# Altium project ECU_FEST24_Rev1.PrjPcb (part 1 of 2)
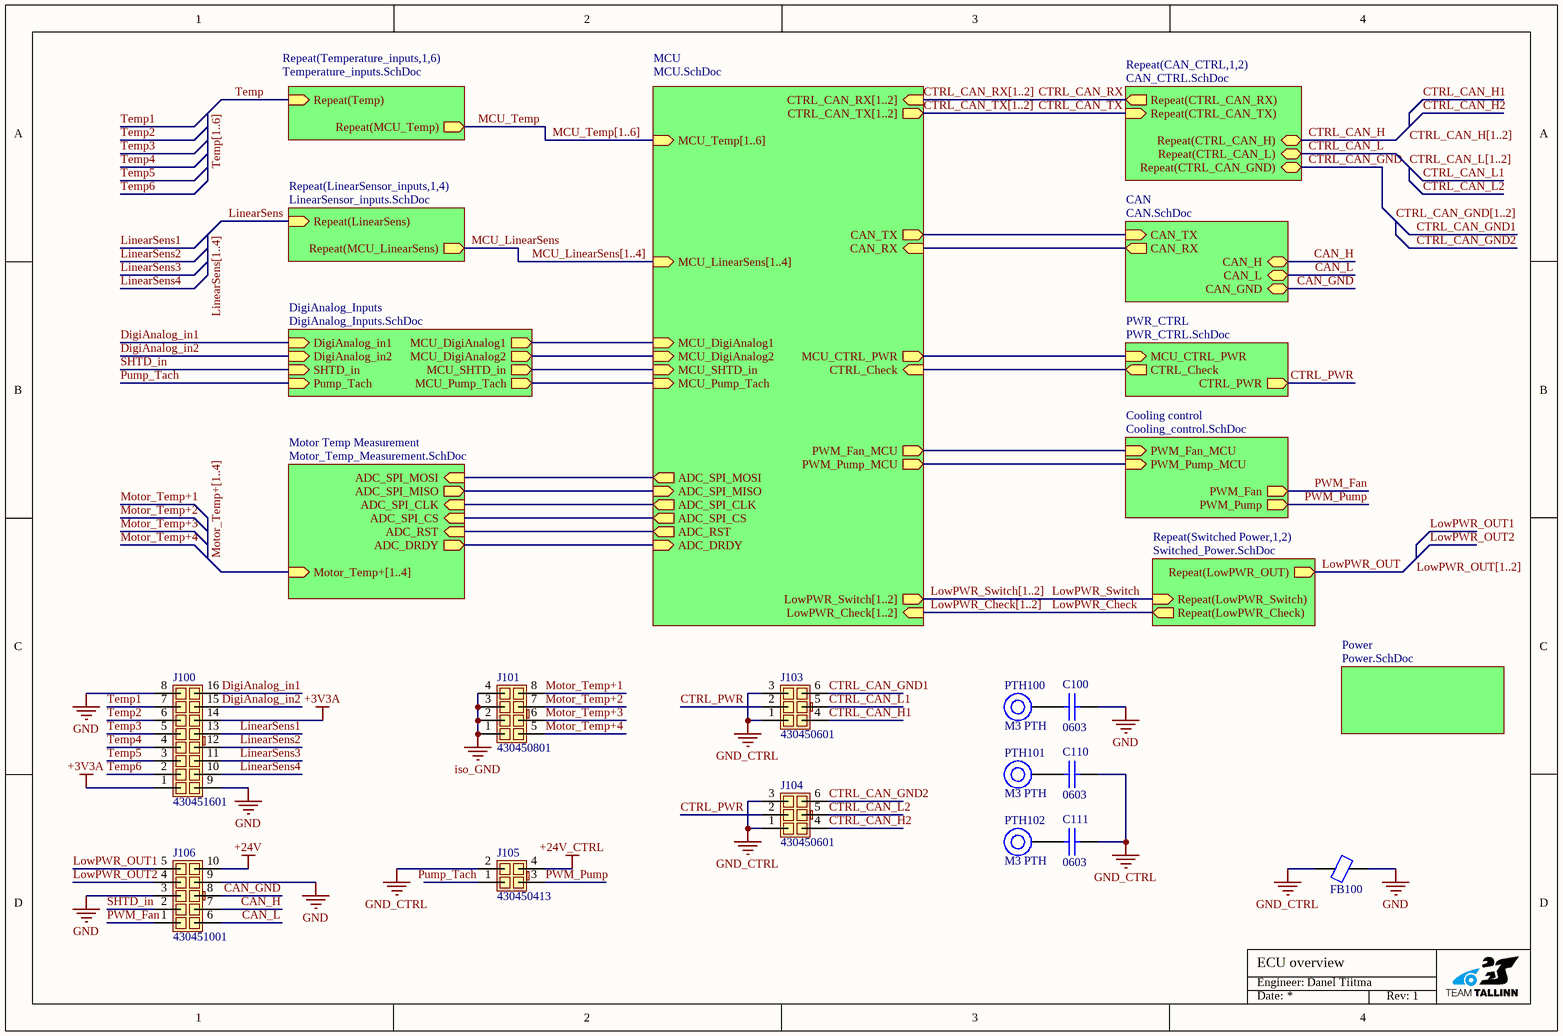
[diagram p0: Overview.SchDoc]
15 sheets, 278 parts. Net scope: hierarchical (ports join the sheet entries above them; power ports are global).
Board file: ECU_FEST24_Rev1.PcbDoc
Sheets:
  Overview.SchDoc
    Temperature_inputs1 = Temperature_inputs.SchDoc
    Temperature_inputs2 = Temperature_inputs.SchDoc
    Temperature_inputs3 = Temperature_inputs.SchDoc
    Temperature_inputs4 = Temperature_inputs.SchDoc
    Temperature_inputs5 = Temperature_inputs.SchDoc
    Temperature_inputs6 = Temperature_inputs.SchDoc
    LinearSensor_inputs1 = LinearSensor_inputs.SchDoc
    LinearSensor_inputs2 = LinearSensor_inputs.SchDoc
    LinearSensor_inputs3 = LinearSensor_inputs.SchDoc
    LinearSensor_inputs4 = LinearSensor_inputs.SchDoc
    MCU = MCU.SchDoc
      Debug = MCU_external_components.SchDoc
    Power = Power.SchDoc
    DigiAnalog_Inputs = DigiAnalog_Inputs.SchDoc
    Motor Temp Measurement = Motor_Temp_Measurement.SchDoc
      Wheatstone_bridge1 = Wheatstone_bridge.SchDoc
      Wheatstone_bridge2 = Wheatstone_bridge.SchDoc
      Wheatstone_bridge3 = Wheatstone_bridge.SchDoc
      Wheatstone_bridge4 = Wheatstone_bridge.SchDoc
      Isolated_Power = Isolated_Power.SchDoc
    Switched Power1 = Switched_Power.SchDoc
    Switched Power2 = Switched_Power.SchDoc
    Cooling control = Cooling_control.SchDoc
    CAN_CTRL1 = CAN_CTRL.SchDoc
    CAN_CTRL2 = CAN_CTRL.SchDoc
    CAN = CAN.SchDoc
    PWR_CTRL = PWR_CTRL.SchDoc

## Sheet Overview.SchDoc: ECU overview
size A4; Engineer: Danel Tiitma; Organization: MTÜ Tudengi Vormel; Address1: Pärnu mnt 62; Address2: Tallinn; Address3: Estonia, 10135; DocumentNumber: 1; Revision: 1; SheetNumber: 1; SheetTotal: 15

### Parts
C100  0603  [CAP [0603] 1608]
C110  0603  [CAP [0603] 1608]
C111  0603  [CAP [0603] 1608]
FB100  742792653  [IND [0603] 1608]  (value not drawn)
J100  430451601  [430451601]
J101  430450801  [430450801]
J103  430450601  [430450601]
J104  430450601  [430450601]
J105  430450413  [430450413]
J106  430451001  [430451001]
PTH100  M3 PTH  [M3 PTH]
PTH101  M3 PTH  [M3 PTH]
PTH102  M3 PTH  [M3 PTH]

### Sub-sheets
CAN = CAN.SchDoc: CAN_TX (in), CAN_RX (out), CAN_H (bidir), CAN_L (bidir), CAN_GND (bidir)
Cooling control = Cooling_control.SchDoc: PWM_Fan_MCU (in), PWM_Fan (out), PWM_Pump_MCU (in), PWM_Pump (out)
DigiAnalog_Inputs = DigiAnalog_Inputs.SchDoc: DigiAnalog_in1 (in), MCU_DigiAnalog1 (out), DigiAnalog_in2 (in), MCU_DigiAnalog2 (out), SHTD_in (in), Pump_Tach (in), MCU_Pump_Tach (out), MCU_SHTD_in (out)
MCU = MCU.SchDoc: MCU_Temp[1..6] (in), MCU_LinearSens[1..4] (in), CTRL_CAN_RX[1..2] (in), CTRL_CAN_TX[1..2] (out), MCU_CTRL_PWR (out), CTRL_Check (in), LowPWR_Switch[1..2] (out), LowPWR_Check[1..2] (in), MCU_DigiAnalog1 (in), MCU_DigiAnalog2 (in), MCU_Pump_Tach (in), MCU_SHTD_in (in), ADC_SPI_CLK (out), ADC_SPI_MOSI (out), ADC_SPI_CS (out), ADC_SPI_MISO (in), ADC_RST (out), ADC_DRDY (in), CAN_TX (out), CAN_RX (in), PWM_Fan_MCU (out), PWM_Pump_MCU (out)
Motor Temp Measurement = Motor_Temp_Measurement.SchDoc: ADC_SPI_CLK (in), ADC_SPI_MOSI (in), ADC_SPI_CS (in), ADC_SPI_MISO (out), ADC_RST (in), ADC_DRDY (out), Motor_Temp+[1..4] (in)
Power = Power.SchDoc: no entries
PWR_CTRL = PWR_CTRL.SchDoc: MCU_CTRL_PWR (in), CTRL_Check (out), CTRL_PWR (out)
Repeat(CAN_CTRL,1,2) = CAN_CTRL.SchDoc: Repeat(CTRL_CAN_TX) (in), Repeat(CTRL_CAN_RX) (out), Repeat(CTRL_CAN_H) (bidir), Repeat(CTRL_CAN_L) (bidir), Repeat(CTRL_CAN_GND) (bidir)
Repeat(LinearSensor_inputs,1,4) = LinearSensor_inputs.SchDoc: Repeat(MCU_LinearSens) (out), Repeat(LinearSens) (in)
Repeat(Switched Power,1,2) = Switched_Power.SchDoc: Repeat(LowPWR_Switch) (in), Repeat(LowPWR_OUT) (out), Repeat(LowPWR_Check) (out)
Repeat(Temperature_inputs,1,6) = Temperature_inputs.SchDoc: Repeat(MCU_Temp) (out), Repeat(Temp) (in)

### Nets
+3V3A: J100.1 J100.14
+24V: J106.10
+24V_CTRL: J105.4
GND: C100.1 FB100.2 J100.8 J100.9 J106.3 J106.9
GND_CTRL: C110.2 C111.2 FB100.1 J103.1 J103.3 J104.1 J104.3 J105.2
iso_GND: J101.1 J101.2 J101.3 J101.4
ADC_DRDY: sheet MCU/ADC_DRDY, sheet Motor Temp Measurement/ADC_DRDY
ADC_RST: sheet MCU/ADC_RST, sheet Motor Temp Measurement/ADC_RST
CAN_GND: J106.8 ; sheet CAN/CAN_GND
CAN_H: J106.7 ; sheet CAN/CAN_H
CAN_L: J106.6 ; sheet CAN/CAN_L
CAN_RX: sheet MCU/CAN_RX, sheet CAN/CAN_RX
CAN_TX: sheet MCU/CAN_TX, sheet CAN/CAN_TX
CTRL_CAN_GND: sheet Repeat(CAN_CTRL,1,2)/Repeat(CTRL_CAN_GND)
CTRL_CAN_GND1: J103.6  [project net CTRL_CAN_GND]
CTRL_CAN_GND2: J104.6  [project net CTRL_CAN_GND]
CTRL_CAN_H: sheet Repeat(CAN_CTRL,1,2)/Repeat(CTRL_CAN_H)
CTRL_CAN_H1: J103.4  [project net CTRL_CAN_H]
CTRL_CAN_H2: J104.4  [project net CTRL_CAN_H]
CTRL_CAN_L: sheet Repeat(CAN_CTRL,1,2)/Repeat(CTRL_CAN_L)
CTRL_CAN_L1: J103.5  [project net CTRL_CAN_L]
CTRL_CAN_L2: J104.5  [project net CTRL_CAN_L]
CTRL_CAN_RX: sheet Repeat(CAN_CTRL,1,2)/Repeat(CTRL_CAN_RX)
CTRL_CAN_TX: sheet Repeat(CAN_CTRL,1,2)/Repeat(CTRL_CAN_TX)
CTRL_PWR: J103.2 J104.2 ; sheet PWR_CTRL/CTRL_PWR
DigiAnalog_in1: J100.16 ; sheet DigiAnalog_Inputs/DigiAnalog_in1
DigiAnalog_in2: J100.15 ; sheet DigiAnalog_Inputs/DigiAnalog_in2
LinearSens: sheet Repeat(LinearSensor_inputs,1,4)/Repeat(LinearSens)
LinearSens1: J100.13
LinearSens2: J100.12
LinearSens3: J100.11
LinearSens4: J100.10
LowPWR_Check: sheet Repeat(Switched Power,1,2)/Repeat(LowPWR_Check)
LowPWR_OUT: sheet Repeat(Switched Power,1,2)/Repeat(LowPWR_OUT)
LowPWR_OUT1: J106.5  [project net LowPWR_OUT]
LowPWR_OUT2: J106.4  [project net LowPWR_OUT]
LowPWR_Switch: sheet Repeat(Switched Power,1,2)/Repeat(LowPWR_Switch)
MCU_DigiAnalog1: sheet MCU/MCU_DigiAnalog1, sheet DigiAnalog_Inputs/MCU_DigiAnalog1
MCU_DigiAnalog2: sheet MCU/MCU_DigiAnalog2, sheet DigiAnalog_Inputs/MCU_DigiAnalog2
MCU_LinearSens: sheet Repeat(LinearSensor_inputs,1,4)/Repeat(MCU_LinearSens)
MCU_Pump_Tach: sheet MCU/MCU_Pump_Tach, sheet DigiAnalog_Inputs/MCU_Pump_Tach
MCU_SHTD_in: sheet MCU/MCU_SHTD_in, sheet DigiAnalog_Inputs/MCU_SHTD_in
MCU_SPI_CLK: sheet MCU/ADC_SPI_CLK, sheet Motor Temp Measurement/ADC_SPI_CLK
MCU_SPI_CS: sheet MCU/ADC_SPI_CS, sheet Motor Temp Measurement/ADC_SPI_CS
MCU_SPI_MISO: sheet MCU/ADC_SPI_MISO, sheet Motor Temp Measurement/ADC_SPI_MISO
MCU_SPI_MOSI: sheet MCU/ADC_SPI_MOSI, sheet Motor Temp Measurement/ADC_SPI_MOSI
MCU_Temp: sheet Repeat(Temperature_inputs,1,6)/Repeat(MCU_Temp)
Motor_Temp+1: J101.8
Motor_Temp+2: J101.7
Motor_Temp+3: J101.6
Motor_Temp+4: J101.5
Pump_Tach: J105.1 ; sheet DigiAnalog_Inputs/Pump_Tach
PWM_Fan: J106.1 ; sheet Cooling control/PWM_Fan
PWM_Pump: J105.3 ; sheet Cooling control/PWM_Pump
SHTD_in: J106.2 ; sheet DigiAnalog_Inputs/SHTD_in
Temp: sheet Repeat(Temperature_inputs,1,6)/Repeat(Temp)
Temp1: J100.7
Temp2: J100.6
Temp3: J100.5
Temp4: J100.4
Temp5: J100.3
Temp6: J100.2
NetC100_2: C100.2 PTH100.1
NetC110_1: C110.1 PTH101.1
NetC111_1: C111.1 PTH102.1
NetC303_1: sheet MCU/CTRL_Check, sheet PWR_CTRL/CTRL_Check
NetQ500_2: sheet MCU/PWM_Pump_MCU, sheet Cooling control/PWM_Pump_MCU
NetQ501_2: sheet MCU/PWM_Fan_MCU, sheet Cooling control/PWM_Fan_MCU
NetR301_1: sheet MCU/MCU_CTRL_PWR, sheet PWR_CTRL/MCU_CTRL_PWR

### Buses and harness runs
bus CTRL_CAN_GND[1..2]
bus CTRL_CAN_H[1..2]
bus CTRL_CAN_L[1..2]
bus CTRL_CAN_RX[1..2] = sheet MCU/CTRL_CAN_RX[1..2]
bus CTRL_CAN_TX[1..2] = sheet MCU/CTRL_CAN_TX[1..2]
bus LinearSens[1..4]
bus LowPWR_Check[1..2] = sheet MCU/LowPWR_Check[1..2]
bus LowPWR_OUT[1..2]
bus LowPWR_Switch[1..2] = sheet MCU/LowPWR_Switch[1..2]
bus MCU_LinearSens[1..4] = sheet MCU/MCU_LinearSens[1..4]
bus MCU_Temp[1..6] = sheet MCU/MCU_Temp[1..6]
bus Motor_Temp+[1..4] = sheet Motor Temp Measurement/Motor_Temp+[1..4]
bus Temp[1..6]

### Notes on the sheet
- Engineer:
- Date:
- Rev:

### Library data of the parts
C100 C110 C111 = CMP-001-00084-16: Default capacitor part; Supplier Part Number: *; Supplier: *; Manufacturer Part Number: *
FB100 = CMP-006-00000-2: Ferrite Chip, 1 Function(s), 0.5A, 2 Pin(s); Manufacturer: WURTH ELEKTRONIK; Price: 0,183; Supplier: Farnell; Manufacturer Part Number: 742792653; Supplier Part Number: 1635686
J100 = CMP-002-00099-1: Rectangular Power Connector, 16 Contact(s), Male, Solder Terminal, Receptacle; Manufacturer: Molex; Manufacturer Part Number: 43045-1601; Price: 5,60; Supplier: Mouser; Supplier Part Number: 538-43045-1601
J101 = CMP-002-00003-1: Rectangular Power Connector, 8 Contact(s), Male, Solder Terminal, Receptacle; Manufacturer: Molex; Manufacturer Part Number: 43045-0801; Price: 2,9; Supplier Part Number: 538-43045-0801; Supplier: Mouser
J103 J104 = CMP-002-00002-1: Rectangular Power Connector, 6 Contact(s), Male, Solder Terminal, Receptacle; Manufacturer: Molex; Manufacturer Part Number: 43045-0601; Supplier Part Number: 538-43045-0601; Supplier: Mouser; Price: 2,37
J105 = CMP-002-00010-1: Rectangular Power Connector, 4 Contact(s), Male, Solder Terminal, Receptacle; Manufacturer Part Number: 43045-0413; Manufacturer: Molex; Supplier Part Number: 538-43045-0413; Supplier: Mouser; Price: 0,763
J106 = CMP-00009-2: Rectangular Power Connector, 10 Contact(s), Male, Solder Terminal, Receptacle; Manufacturer: Molex; Design Item ID: 430451001; Supplier: Mouser; Supplier Part Number: 538-43045-1001; Datasheet: https://www.molex.com/pdm_docs/sd/430451000_sd.pdf; Manufacturer Part Number: 430451001; Price: 3,74 €
PTH100-PTH102 = CMP-00028-00000-3: M3 plated through hole for mounting; Manufacturer Part Number: *; Supplier Part Number: *; Supplier: *

## Sheet Temperature_inputs.SchDoc: Analog temperature
size A4; Engineer: Rain Sarapuu; DocumentNumber: 9; Revision: 1; SheetNumber: 10; SheetTotal: 15
Used 6 times, as channels Temperature_inputs1, Temperature_inputs2, Temperature_inputs3, Temperature_inputs4, Temperature_inputs5, Temperature_inputs6. Parts and nets are listed once, with the designators drawn on the sheet.
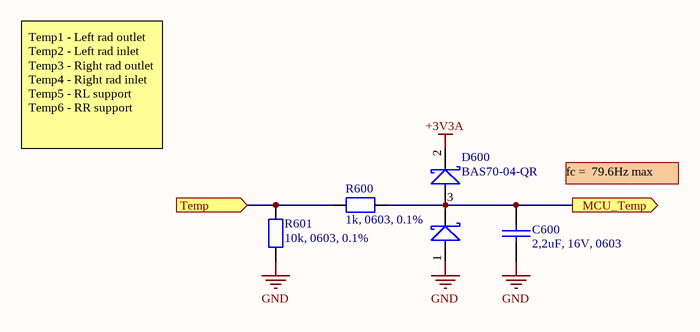
[diagram p1: Temperature_inputs.SchDoc]

### Parts
C600  2,2uF, 16V, 0603  [CAP [0603] 1608]
D600  BAS70-04-QR  [SOT23-3]
R600  1k, 0603, 0.1%  [RES [0603] 1608]
R601  10k, 0603, 0.1%  [RES [0603] 1608]

### Ports
MCU_Temp (out), Temp (in)

### Nets
+3V3A: D600.2
GND: C600.2 D600.1 R601.2
MCU_Temp: C600.1 D600.3 R600.1 ; port MCU_Temp
Temp: R600.2 R601.1 ; port Temp

### Channels
Temperature_inputs1: designators end in 1; ports MCU_Temp=MCU_Temp1 Temp=Temp1
Temperature_inputs2: designators end in 2; ports MCU_Temp=MCU_Temp2 Temp=Temp2
Temperature_inputs3: designators end in 3; ports MCU_Temp=MCU_Temp3 Temp=Temp3
Temperature_inputs4: designators end in 4; ports MCU_Temp=MCU_Temp4 Temp=Temp4
Temperature_inputs5: designators end in 5; ports MCU_Temp=MCU_Temp5 Temp=Temp5
Temperature_inputs6: designators end in 6; ports MCU_Temp=MCU_Temp6 Temp=Temp6

### Notes on the sheet
- Temp1 - Left rad outlet
  Temp2 - Left rad inlet
  Temp3 - Right rad outlet
  Temp4 - Right rad inlet
  Temp5 - RL support
  Temp6 - RR support
- fc =  79.6Hz max
- Engineer:
- Date:
- Rev:

### Library data of the parts
C600 = CMP-001-00084-16: Default capacitor part; Supplier Part Number: *; Supplier: *; Manufacturer Part Number: *
D600 = CMP-004-00033-4: Diode Small Signal Schottky 70V 70mA 3-Pin SOT-23 T/R; Manufacturer: Nexperia; Supplier Part Number: 771-BAS70-04-QR; Manufacturer Part Number: BAS70-04-QR; Supplier: Mouser; Price: 0,242
R600 R601 = CMP-009-00038-12: Standard resistor part; Supplier Part Number: *; Manufacturer Part Number: *; Supplier: *

## Sheet LinearSensor_inputs.SchDoc: Linear sensor input
size A4; Engineer: Danel Tiitma; Organization: MTÜ Tudengi Vormel; Address1: Pärnu mnt 62; Address2: Tallinn; Address3: Estonia, 10135; DocumentNumber: 10; Revision: 1; SheetNumber: 11; SheetTotal: 15
Used 4 times, as channels LinearSensor_inputs1, LinearSensor_inputs2, LinearSensor_inputs3, LinearSensor_inputs4. Parts and nets are listed once, with the designators drawn on the sheet.
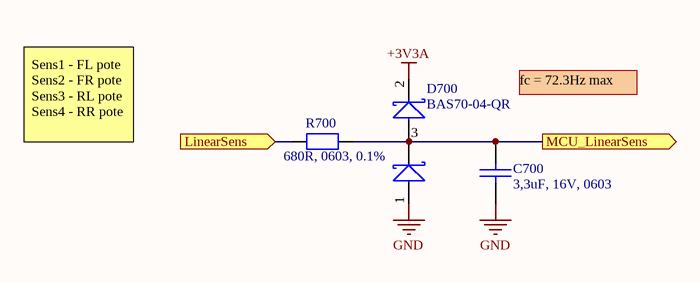
[diagram p2: LinearSensor_inputs.SchDoc]

### Parts
C700  3,3uF, 16V, 0603  [CAP [0603] 1608]
D700  BAS70-04-QR  [SOT23-3]
R700  680R, 0603, 0.1%  [RES [0603] 1608]

### Ports
LinearSens (in), MCU_LinearSens (out)

### Nets
+3V3A: D700.2
GND: C700.2 D700.1
LinearSens: R700.2 ; port LinearSens
MCU_LinearSens: C700.1 D700.3 R700.1 ; port MCU_LinearSens

### Channels
LinearSensor_inputs1: designators end in 1; ports LinearSens=LinearSens1 MCU_LinearSens=MCU_LinearSens1
LinearSensor_inputs2: designators end in 2; ports LinearSens=LinearSens2 MCU_LinearSens=MCU_LinearSens2
LinearSensor_inputs3: designators end in 3; ports LinearSens=LinearSens3 MCU_LinearSens=MCU_LinearSens3
LinearSensor_inputs4: designators end in 4; ports LinearSens=LinearSens4 MCU_LinearSens=MCU_LinearSens4

### Notes on the sheet
- fc = 72.3Hz max
- Sens1 - FL pote
  Sens2 - FR pote
  Sens3 - RL pote
  Sens4 - RR pote
- Engineer:
- Date:
- Rev:

### Library data of the parts
C700 = CMP-001-00084-16: Default capacitor part; Supplier Part Number: *; Supplier: *; Manufacturer Part Number: *
D700 = CMP-004-00033-4: as D600 on sheet Temperature_inputs; Supplier Part Number: 771-BAS70-04-QR; Manufacturer Part Number: BAS70-04-QR; Supplier: Mouser; Price: 0,242
R700 = CMP-009-00038-12: Standard resistor part; Supplier Part Number: *; Manufacturer Part Number: *; Supplier: *

## Sheet MCU.SchDoc: MCU
size A4; Engineer: Danel Tiitma; DocumentNumber: 3; Revision: 1; SheetNumber: 3; SheetTotal: 15
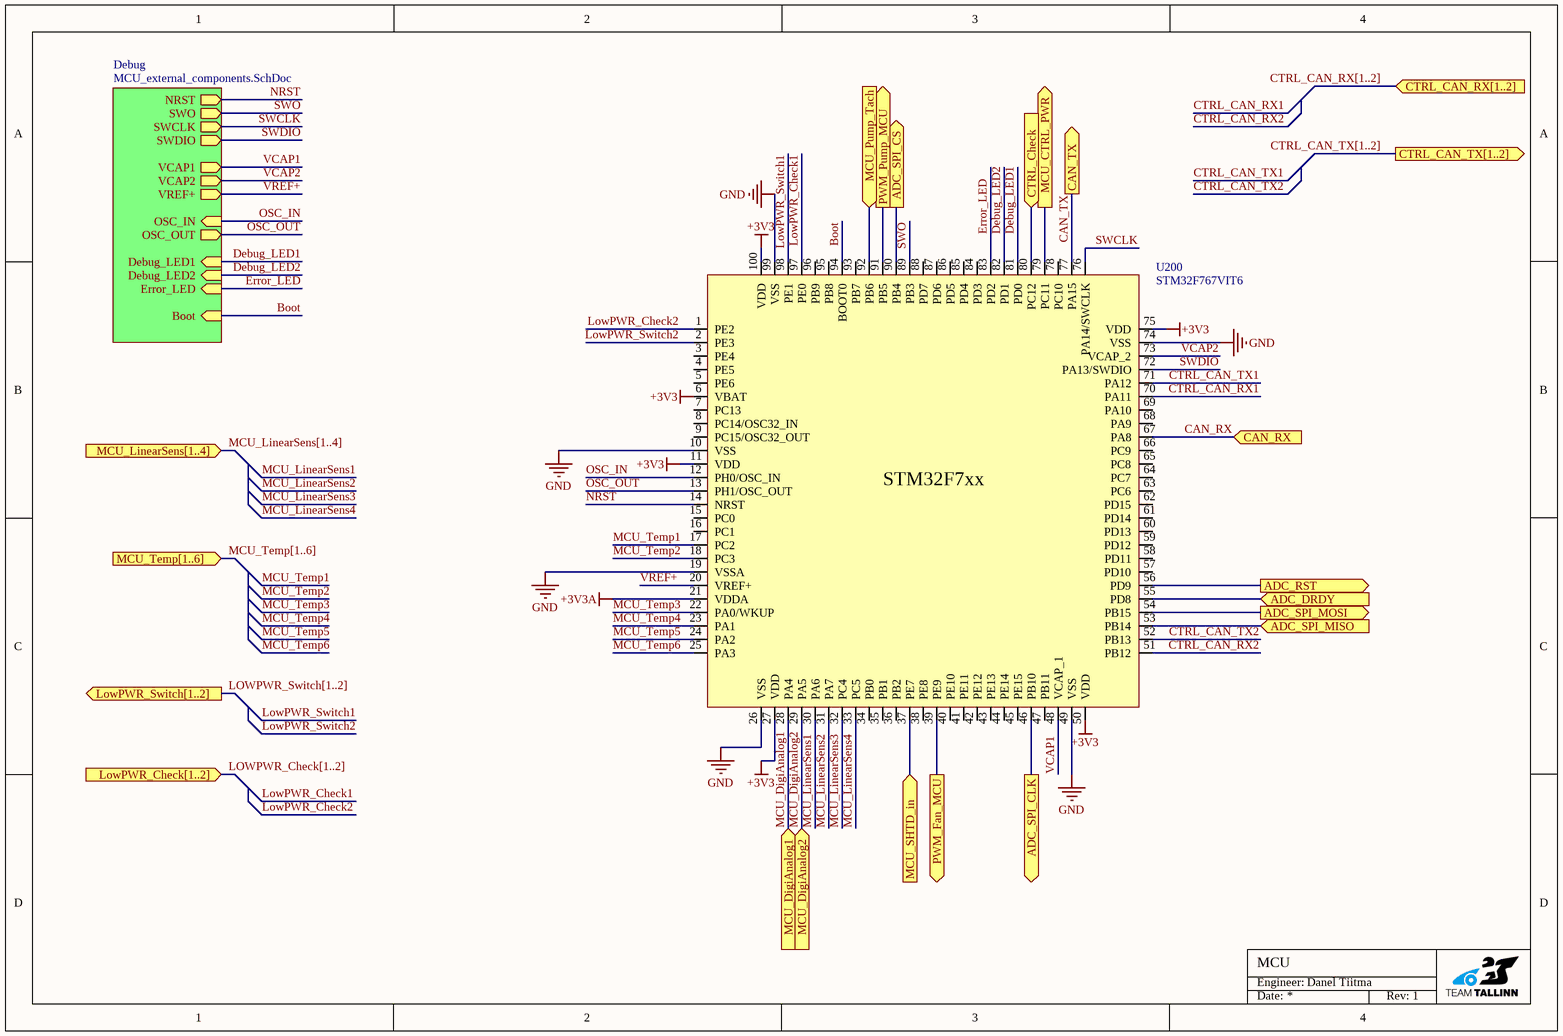
[diagram p3: MCU.SchDoc]

### Parts
U200  STM32F767VIT6  [LQFP-100]

### Sub-sheets
Debug = MCU_external_components.SchDoc: SWO (out), NRST (out), SWDIO (out), SWCLK (out), VCAP2 (out), OSC_IN (in), OSC_OUT (out), VREF+ (out), Debug_LED1 (in), Debug_LED2 (in), Error_LED (in), Boot (in), VCAP1 (out)

### Ports
ADC_DRDY (in), ADC_RST (out), ADC_SPI_CLK (out), ADC_SPI_CS (out), ADC_SPI_MISO (in), ADC_SPI_MOSI (out), CAN_RX (in), CAN_TX (out), CTRL_CAN_RX[1..2] (in), CTRL_CAN_TX[1..2] (out), CTRL_Check (in), LowPWR_Check[1..2] (in), LowPWR_Switch[1..2] (out), MCU_CTRL_PWR (out), MCU_DigiAnalog1 (in), MCU_DigiAnalog2 (in), MCU_LinearSens[1..4] (in), MCU_Pump_Tach (in), MCU_SHTD_in (in), MCU_Temp[1..6] (in), PWM_Fan_MCU (out), PWM_Pump_MCU (out)

### Nets
+3V3: U200.6(VBAT) U200.11(VDD) U200.27(VDD) U200.50(VDD) U200.75(VDD) U200.100(VDD)
+3V3A: U200.21(VDDA)
GND: U200.10(VSS) U200.19(VSSA) U200.26(VSS) U200.49(VSS) U200.74(VSS) U200.99(VSS)
ADC_DRDY: U200.55(PD8) ; port ADC_DRDY
ADC_RST: U200.56(PD9) ; port ADC_RST
Boot: U200.94(BOOT0) ; sheet Debug/Boot
CAN_RX: U200.67(PA8) ; port CAN_RX
CAN_TX: U200.77(PA15) ; port CAN_TX
CTRL_CAN_RX1: U200.70(PA11)  [project net CTRL_CAN_RX]
CTRL_CAN_RX2: U200.51(PB12)  [project net CTRL_CAN_RX]
CTRL_CAN_TX1: U200.71(PA12)  [project net CTRL_CAN_TX]
CTRL_CAN_TX2: U200.52(PB13)  [project net CTRL_CAN_TX]
Debug_LED1: U200.81(PD0) ; sheet Debug/Debug_LED1
Debug_LED2: U200.82(PD1) ; sheet Debug/Debug_LED2
Error_LED: U200.83(PD2) ; sheet Debug/Error_LED
LowPWR_Check1: U200.97(PE0)
LowPWR_Check2: U200.1(PE2)
LowPWR_Switch1: U200.98(PE1)
LowPWR_Switch2: U200.2(PE3)
MCU_DigiAnalog1: U200.28(PA4) ; port MCU_DigiAnalog1
MCU_DigiAnalog2: U200.29(PA5) ; port MCU_DigiAnalog2
MCU_LinearSens1: U200.30(PA6)
MCU_LinearSens2: U200.31(PA7)
MCU_LinearSens3: U200.32(PC4)
MCU_LinearSens4: U200.33(PC5)
MCU_Pump_Tach: U200.92(PB6) ; port MCU_Pump_Tach
MCU_SHTD_in: U200.37(PE7) ; port MCU_SHTD_in
MCU_SPI_CLK: U200.46(PB10) ; port ADC_SPI_CLK
MCU_SPI_CS: U200.90(PB4) ; port ADC_SPI_CS
MCU_SPI_MISO: U200.53(PB14) ; port ADC_SPI_MISO
MCU_SPI_MOSI: U200.54(PB15) ; port ADC_SPI_MOSI
MCU_Temp1: U200.17(PC2)
MCU_Temp2: U200.18(PC3)
MCU_Temp3: U200.22(PA0/WKUP)
MCU_Temp4: U200.23(PA1)
MCU_Temp5: U200.24(PA2)
MCU_Temp6: U200.25(PA3)
NRST: U200.14(NRST) ; sheet Debug/NRST
OSC_IN: U200.12(PH0/OSC_IN) ; sheet Debug/OSC_IN
OSC_OUT: U200.13(PH1/OSC_OUT) ; sheet Debug/OSC_OUT
SWCLK: U200.76(PA14/SWCLK) ; sheet Debug/SWCLK
SWDIO: U200.72(PA13/SWDIO) ; sheet Debug/SWDIO
SWO: U200.89(PB3) ; sheet Debug/SWO
VCAP1: U200.48(VCAP_1) ; sheet Debug/VCAP1
VCAP2: U200.73(VCAP_2) ; sheet Debug/VCAP2
VREF+: U200.20(VREF+) ; sheet Debug/VREF+
NetC303_1: U200.80(PC12) ; port CTRL_Check
NetQ500_2: U200.91(PB5) ; port PWM_Pump_MCU
NetQ501_2: U200.39(PE9) ; port PWM_Fan_MCU
NetR301_1: U200.79(PC11) ; port MCU_CTRL_PWR

Not connected (* = marked no-connect by the designer): U200 3(PE4) 4(PE5) 5(PE6) 7(PC13) 8(PC14/OSC32_IN) 9(PC15/OSC32_OUT) 15(PC0) 16(PC1) 34(PB0) 35(PB1) 36(PB2) 38(PE8) 40(PE10) 41(PE11) 42(PE12) 43(PE13) 44(PE14) 45(PE15) 47(PB11) 57(PD10) 58(PD11) 59(PD12) 60(PD13) 61(PD14) 62(PD15) 63(PC6) 64(PC7) 65(PC8) 66(PC9) 68(PA9) 69(PA10) 78(PC10) 84(PD3) 85(PD4) 86(PD5) 87(PD6) 88(PD7) 93(PB7) 95(PB8) 96(PB9)

### Buses and harness runs
bus CTRL_CAN_RX[1..2] = port CTRL_CAN_RX[1..2]
bus CTRL_CAN_TX[1..2] = port CTRL_CAN_TX[1..2]
bus LOWPWR_Check[1..2] = port LowPWR_Check[1..2]
bus LOWPWR_Switch[1..2] = port LowPWR_Switch[1..2]
bus MCU_LinearSens[1..4] = port MCU_LinearSens[1..4]
bus MCU_Temp[1..6] = port MCU_Temp[1..6]

### Notes on the sheet
- Engineer:
- Date:
- Rev:
- (in symbol CMP-020-00001-1) STM32F7xx

### Library data of the parts
U200 = CMP-020-00001-1: RISC Microcontroller, 32-Bit, 216MHz; Manufacturer: STMICROELECTRONICS; Manufacturer Part Number: STM32F767VIT6; Supplier: Mouser; Supplier Part Number: 511-STM32F767VIT6

## Sheet MCU_external_components.SchDoc: MCU ext. components
size A4; Engineer: Danel Tiitma; Organization: MTÜ Tudengi Vormel; Address1: Pärnu mnt 62; Address2: Tallinn; Address3: Estonia, 10135; DocumentNumber: 4; Revision: 1; SheetNumber: 4; SheetTotal: 15
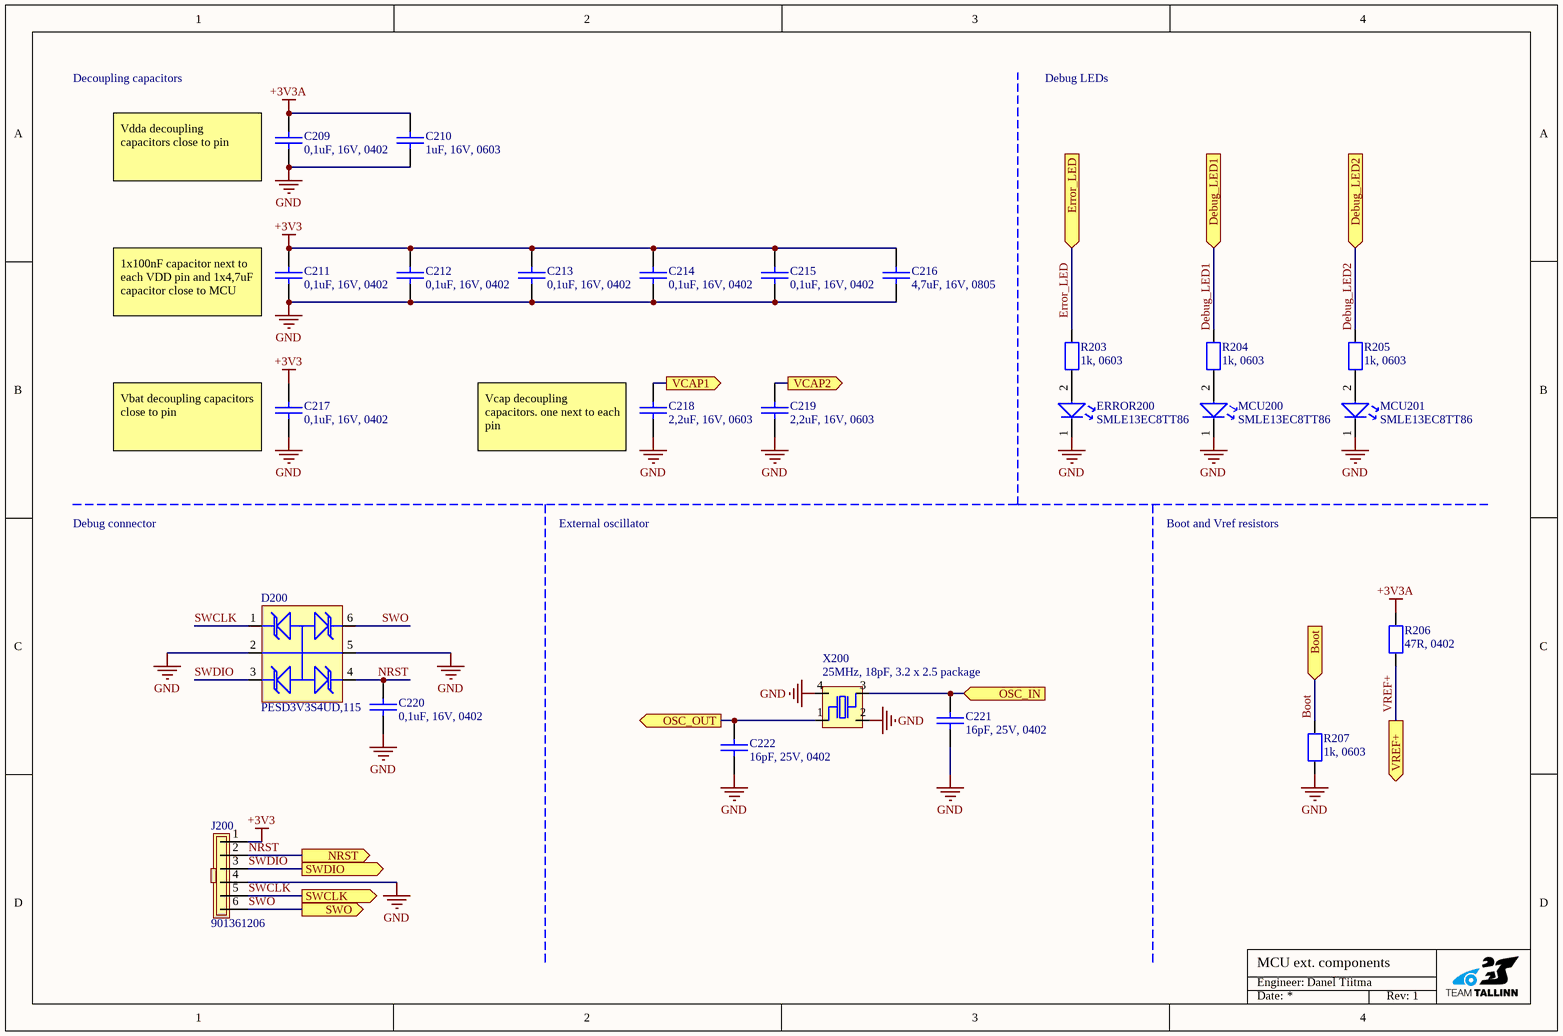
[diagram p4: MCU_external_components.SchDoc]

### Parts
C209  0,1uF, 16V, 0402  [CAP [0402] 1005]
C210  1uF, 16V, 0603  [CAP [0603] 1608]
C211  0,1uF, 16V, 0402  [CAP [0402] 1005]
C212  0,1uF, 16V, 0402  [CAP [0402] 1005]
C213  0,1uF, 16V, 0402  [CAP [0402] 1005]
C214  0,1uF, 16V, 0402  [CAP [0402] 1005]
C215  0,1uF, 16V, 0402  [CAP [0402] 1005]
C216  4,7uF, 16V, 0805  [CAP [0805] 2012]
C217  0,1uF, 16V, 0402  [CAP [0402] 1005]
C218  2,2uF, 16V, 0603  [CAP [0603] 1608]
C219  2,2uF, 16V, 0603  [CAP [0603] 1608]
C220  0,1uF, 16V, 0402  [CAP [0402] 1005]
C221  16pF, 25V, 0402  [CAP [0402] 1005]
C222  16pF, 25V, 0402  [CAP [0402] 1005]
D200  PESD3V3S4UD,115  [SOT23-6]
ERROR200  SMLE13EC8TT86  [LED [0603] 1608]
J200  901361206  [901361206]
MCU200  SMLE13EC8TT86  [LED [0603] 1608]
MCU201  SMLE13EC8TT86  [LED [0603] 1608]
R203  1k, 0603  [RES [0603] 1608]
R204  1k, 0603  [RES [0603] 1608]
R205  1k, 0603  [RES [0603] 1608]
R206  47R, 0402  [RES [0402] 1005]
R207  1k, 0603  [RES [0603] 1608]
X200  25MHz, 18pF, 3.2 x 2.5 package  [Crystal 3.2x2.5mm]

### Ports
Boot (in), Debug_LED1 (in), Debug_LED2 (in), Error_LED (in), NRST (out), OSC_IN (in), OSC_OUT (out), SWCLK (out), SWDIO (out), SWO (out), VCAP1 (out), VCAP2 (out), VREF+ (out)

### Nets
+3V3: C211.2 C212.2 C213.2 C214.2 C215.2 C216.2 C217.2 J200.1
+3V3A: C209.2 C210.2 R206.2
GND: C209.1 C210.1 C211.1 C212.1 C213.1 C214.1 C215.1 C216.1 C217.1 C218.2 C219.2 C220.2 C221.2 C222.2 D200.2(GND) D200.5(GND) ERROR200.1 J200.4 MCU200.1 MCU201.1 R207.1 X200.2 X200.4
Boot: R207.2 ; port Boot
Debug_LED1: R204.2 ; port Debug_LED1
Debug_LED2: R205.2 ; port Debug_LED2
Error_LED: R203.2 ; port Error_LED
NRST: C220.1 D200.4(K3) J200.2 ; port NRST
OSC_IN: C221.1 X200.3 ; port OSC_IN
OSC_OUT: C222.1 X200.1 ; port OSC_OUT
SWCLK: D200.1(K1) J200.5 ; port SWCLK
SWDIO: D200.3(K2) J200.3 ; port SWDIO
SWO: D200.6(K4) J200.6 ; port SWO
VCAP1: C218.1 ; port VCAP1
VCAP2: C219.1 ; port VCAP2
VREF+: R206.1 ; port VREF+
NetERROR200_2: ERROR200.2 R203.1
NetMCU200_2: MCU200.2 R204.1
NetMCU201_2: MCU201.2 R205.1

### Notes on the sheet
- Decoupling capacitors
- Debug LEDs
- (near C209) Vdda decoupling capacitors close to pin
- (near C211) 1x100nF capacitor next to each VDD pin and 1x4,7uF capacitor close to MCU
- (near C217) Vbat decoupling capacitors close to pin
- (near C218) Vcap decoupling capacitors. one next to each pin
- Debug connector
- External oscillator
- Boot and Vref resistors
- Engineer:
- Date:
- Rev:

### Library data of the parts
C209-C217 C220 = CMP-001-00084-16: Default capacitor part; Supplier Part Number: *; Supplier: *; Manufacturer Part Number: *
C218 C219 = CMP-001-00014-2: Ceramic Capacitor, Multilayer, Ceramic, 16V, 20% +Tol, 20% -Tol, X5R, 15% TC, 2.2uF, Surface Mount, 0603; Manufacturer: TDK; Manufacturer Part Number: CGA3E1X5R1C225M080AC; Supplier Part Number: 810-CGA3E1X5R1C225MC; Price: 0,205; Supplier: Mouser; Datasheet: https://product.tdk.com/system/files/dam/doc/product/capacitor/ceramic/mlcc/catalog/mlcc_automotive_general_en.pdf
C221 C222 = CMP-001-00015-1: Ceramic Capacitor, Multilayer, Ceramic, 25V, 10% +Tol, 10% -Tol, X8R, 15% TC, 0.000016uF, Surface Mount, 0402; Manufacturer Part Number: C0402C160K3HACAUTO; Manufacturer: KEMET; Supplier: Digikey; Supplier Part Number: 399-C0402C160K3HACAUTOCT-ND; Price: 0.09
D200 = CMP-004-00032-2: Trans Voltage Suppressor Diode, 200W, 3.3V V(RWM), Unidirectional, 4 Element, Silicon; Manufacturer: Nexperia; Price: 0,428; Supplier Part Number: 771-PESD3V3S4UDT/R; Supplier: Mouser; Manufacturer Part Number: PESD3V3S4UD,115
ERROR200 MCU200 MCU201 = CMP-004-00006-2: Single Color LED, Green, Colorless Transparent, 1.2mm; Manufacturer Part Number: SMLE13EC8TT86; Supplier Part Number: 755-SMLE13EC8TT86; Supplier: Mouser
J200 = CMP-002-00026-4: Board Connector, 6 Contact(s), 1 Row(s), Male, Straight, 0.1 inch Pitch, Solder Terminal, Locking, Black Insulator, Receptacle; Manufacturer Part Number: 90136-1206; Manufacturer: Molex; Supplier Part Number: 538-90136-1206; Price: 1.53; Supplier: Mouser
R203-R207 = CMP-009-00038-12: Standard resistor part; Supplier Part Number: *; Manufacturer Part Number: *; Supplier: *
X200 = CMP-003-00030-3: Crystal 25MHz ±20ppm (Tol) ±30ppm (Stability) 18pF FUND 60Ohm 4-Pin Ultra Mini-CSMD T/R; Manufacturer Part Number: ABM8G-25.000MHZ-18-D2Y-T; Manufacturer: ABRACON; Supplier Part Number: 2101339; Supplier: Farnell

## Sheet Power.SchDoc: Power
size A4; Engineer: Danel Tiitma; DocumentNumber: 2; Revision: 1; SheetNumber: 2; SheetTotal: 15
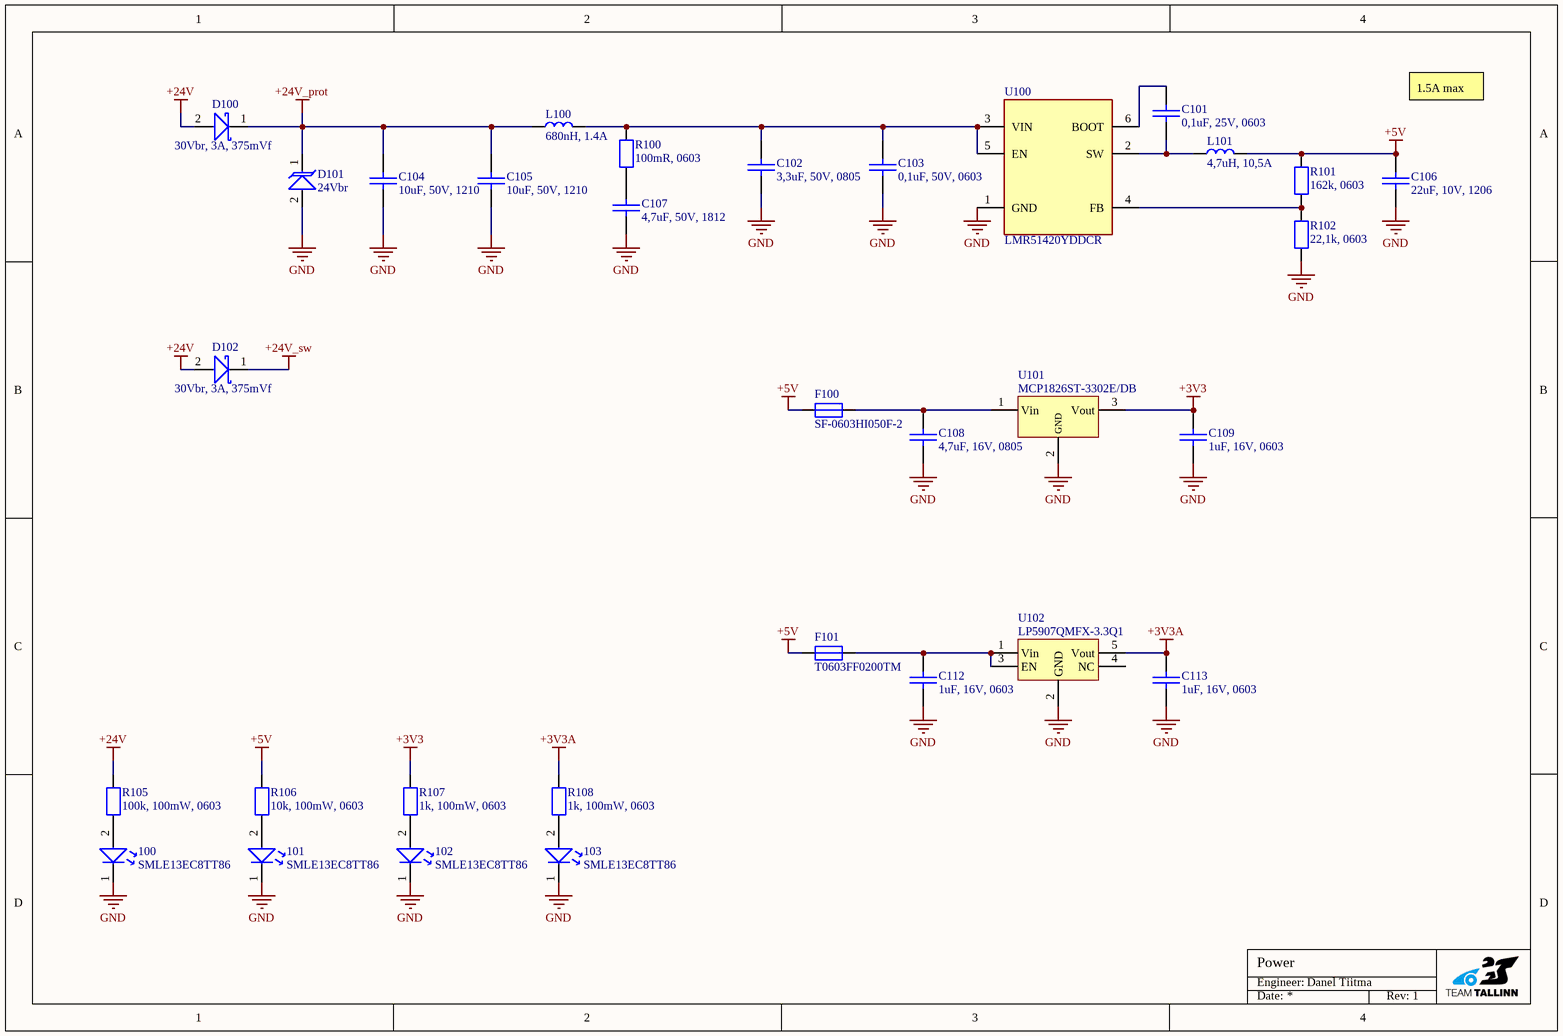
[diagram p5: Power.SchDoc]

### Parts
100  SMLE13EC8TT86  [LED [0603] 1608]
101  SMLE13EC8TT86  [LED [0603] 1608]
102  SMLE13EC8TT86  [LED [0603] 1608]
103  SMLE13EC8TT86  [LED [0603] 1608]
C101  0,1uF, 25V, 0603  [CAP [0603] 1608]
C102  3,3uF, 50V, 0805  [CAP [0805] 2012]
C103  0,1uF, 50V, 0603  [CAP [0603] 1608]
C104  10uF, 50V, 1210  [CAP [1210] 3225]
C105  10uF, 50V, 1210  [CAP [1210] 3225]
C106  22uF, 10V, 1206  [CAP [1206] 3216]
C107  4,7uF, 50V, 1812  [CAP [1812] 4532]
C108  4,7uF, 16V, 0805  [CAP [0805] 2012]
C109  1uF, 16V, 0603  [CAP [0603] 1608]
C112  1uF, 16V, 0603  [CAP [0603] 1608]
C113  1uF, 16V, 0603  [CAP [0603] 1608]
D100  30Vbr, 3A, 375mVf  [SOD-128]
D101  24Vbr  [SOD-123W]
D102  30Vbr, 3A, 375mVf  [SOD-128]
F100  SF-0603HI050F-2  [FUSE [0603] 1608]
F101  T0603FF0200TM  [FUSE [0603] 1608]
L100  680nH, 1.4A  [PFL1609-681MEW-Footprint-1]
L101  4,7uH, 10,5A  [FP-XAL6060-472MEC-MFG]
R100  100mR, 0603  [RES [0603] 1608]
R101  162k, 0603  [RES [0603] 1608]
R102  22,1k, 0603  [RES [0603] 1608]
R105  100k, 100mW, 0603  [RES [0603] 1608]
R106  10k, 100mW, 0603  [RES [0603] 1608]
R107  1k, 100mW, 0603  [RES [0603] 1608]
R108  1k, 100mW, 0603  [RES [0603] 1608]
U100  LMR51420YDDCR  [SOT23-6]
U101  MCP1826ST-3302E/DB  [SOT223]
U102  LP5907QMFX-3.3Q1  [SOT23-5]

### Nets
+3V3: C109.1 R107.2 U101.3(Vout)
+3V3A: C113.1 R108.2 U102.5(Vout)
+5V: C106.2 F100.1 F101.2 L101.2 R101.1 R106.2
+24V: D100.2(A) D102.2(A) R105.2
+24V_prot: C104.1 C105.1 D100.1(K) D101.1(K) L100.1
+24V_sw: D102.1(K)
GND: 100.1 101.1 102.1 103.1 C102.1 C103.1 C104.2 C105.2 C106.1 C107.2 C108.2 C109.2 C112.2 C113.2 D101.2(A) R102.2 U100.1(GND) U101.2(GND) U102.2(GND)
Net100_2: 100.2 R105.1
Net101_2: 101.2 R106.1
Net102_2: 102.2 R107.1
Net103_2: 103.2 R108.1
NetC101_1: C101.1 L101.1 U100.2(SW)
NetC101_2: C101.2 U100.6(BOOT)
NetC102_2: C102.2 C103.2 L100.2 R100.1 U100.3(VIN) U100.5(EN)
NetC107_1: C107.1 R100.2
NetC108_1: C108.1 F100.2 U101.1(Vin)
NetC112_1: C112.1 F101.1 U102.1(Vin) U102.3(EN)
NetR101_2: R101.2 R102.1 U100.4(FB)

Not connected (* = marked no-connect by the designer): U102 4(NC)

### Notes on the sheet
- 1.5A max
- Engineer:
- Date:
- Rev:

### Library data of the parts
100-103 = CMP-004-00006-2: as ERROR200 on sheet MCU_external_components; Manufacturer Part Number: SMLE13EC8TT86; Supplier Part Number: 755-SMLE13EC8TT86; Supplier: Mouser
C101 C103 C108 C109 C112 C113 = CMP-001-00084-16: Default capacitor part; Supplier Part Number: *; Supplier: *; Manufacturer Part Number: *
C102 = CMP-001-00024-1: Ceramic Capacitor, Multilayer, Ceramic, 50V, 10% +Tol, 10% -Tol, X5R, 15% TC, 3.3uF, Surface Mount, 0805; Manufacturer: TDK; Manufacturer Part Number: C2012X5R1H335K125AB; Supplier Part Number: 810-C2012X5R1H335K; Price: 0,521; Supplier: Mouser
C104 C105 = CMP-001-00022-1: Ceramic Capacitor, Multilayer, Ceramic, 50V, 20% +Tol, 20% -Tol, X7R, 15% TC, 10uF, Surface Mount, 1210; Manufacturer Part Number: C3225X7R1H106M250AC; Manufacturer: TDK; Price: 0,772; Supplier Part Number: 810-C3225X7R1H106MAC; Supplier: Mouser
C106 = CMP-001-00025-1: Ceramic Capacitor, Multilayer, Ceramic, 10V, 10% +Tol, 10% -Tol, X7R, 15% TC, 22uF, Surface Mount, 1206; Manufacturer: Murata; Manufacturer Part Number: GRM31CR71A226KE15L; Supplier Part Number: 81-GRM31CR71A226K15L; Supplier: Mouser
C107 = CMP-001-00023-1: Ceramic Capacitor, Multilayer, Ceramic, 100V, 10% +Tol, 10% -Tol, X7S, 22% TC, 4.7uF, Surface Mount, 1812; Manufacturer Part Number: C4532X7S2A475K230KB; Manufacturer: TDK; Supplier Part Number: 810-C4532X7S2A475KKB; Supplier: Mouser; Price: 1,20
D100 D102 = CMP-004-00015-1: Rectifier Diode, Schottky, 1 Phase, 1 Element, 2A, Silicon; Manufacturer Part Number: PMEG3020EP,115; Supplier Part Number: 771-PMEG3020EP115; Supplier: Mouser
D101 = CMP-004-00014-3: Trans Voltage Suppressor Diode, 400W, 24V V(RWM), Unidirectional, 1 Element, Silicon; Manufacturer Part Number: PTVS24VS1UR,115; Manufacturer: Nexperia; Supplier Part Number: 1829247; Datasheet: https://4donline.ihs.com/images/VipMasterIC/IC/NEXP/NEXP-S-A0003507774/NEXP-S-A0003507774-1.pdf?hkey=6D3A4C79FDBF58556ACFDE234799DDF0; Supplier: Farnell
F100 = CMP-005-00023-1: Electric Fuse, 0.5A, 35VAC, 65VDC, 50A (IR), Surface Mount; Manufacturer: Bourns; Supplier Part Number: 652-SF-0603HI050F-2; Manufacturer Part Number: SF-0603HI050F-2; Supplier: Mouser; Price: 0,605
F101 = CMP-005-00007-2: Fuse, Very Fast Act, 0.2A, 65VDC, 0603 Rohs Compliant: Yes; Supplier Part Number: 3701343; Manufacturer Part Number: T0603FF0200TM; Supplier: Farnell
L100 = CMP-006-00017-1: General Purpose Inductor, 0.68uH, 20%, 1 Element, Composite-Core, SMD, 0603; Manufacturer: Coilcraft; Manufacturer Part Number: PFL1609-681MEW; Datasheet: https://www.mouser.ee/datasheet/2/597/pfl1609-270712.pdf; Supplier: Mouser; Supplier Part Number: 994-PFL1609-681MEW; Price: 0,651
L101 = CMP-006-00022-1: General Purpose Inductor, 4.7uH, 20%, 1 Element, Composite-Core, SMD, 2625; Manufacturer: Coilcraft; Manufacturer Part Number: XAL6060-472MEC; Supplier Part Number: 994-XAL6060-472MEC; Price: 3,06; Supplier: Mouser
R100-R102 R105-R108 = CMP-009-00038-12: Standard resistor part; Supplier Part Number: *; Manufacturer Part Number: *; Supplier: *
U100 = CMP-019-00028-1: SIMPLE SWITCHER® power converter 4.5-V to 36-V, 2-A, synchronous buck with 40-µA IQ 6-SOT-23-THIN -40 to 150; Manufacturer: Texas Instruments; Manufacturer Part Number: LMR51420YDDCR; Supplier: Mouser; Price: 1,07; Datasheet: https://www.ti.com/general/docs/suppproductinfo.tsp?distId=26&gotoUrl=https://www.ti.com/lit/gpn/lmr51420; Supplier Part Number: 595-LMR51420YDDCR
U101 = CMP-019-00036-1: Fixed Positive LDO Regulator, 3.3V, 0.4V Dropout, CMOS, PDSO3; Manufacturer: Microchip; Manufacturer Part Number: 579-MCP1826ST3302EDB; Supplier Part Number: 579-MCP1826ST3302EDB; Supplier: Mouser
U102 = CMP-019-00018-1: Fixed Positive LDO Regulator, 3.3V, 0.25V Dropout, PDSO5; Manufacturer: Texas Instruments; Manufacturer Part Number: LP5907QMFX-3.3Q1; Supplier Part Number: 595-LP5907QMFX-3.3Q1; Supplier: Mouser

## Sheet DigiAnalog_Inputs.SchDoc: DigiAnalog inputs
size A4; Engineer: Danel Tiitma; Organization: MTÜ Tudengi Vormel; Address1: Pärnu mnt 62; Address2: Tallinn; Address3: Estonia, 10135; DocumentNumber: 11; Revision: 1; SheetNumber: 12; SheetTotal: 15
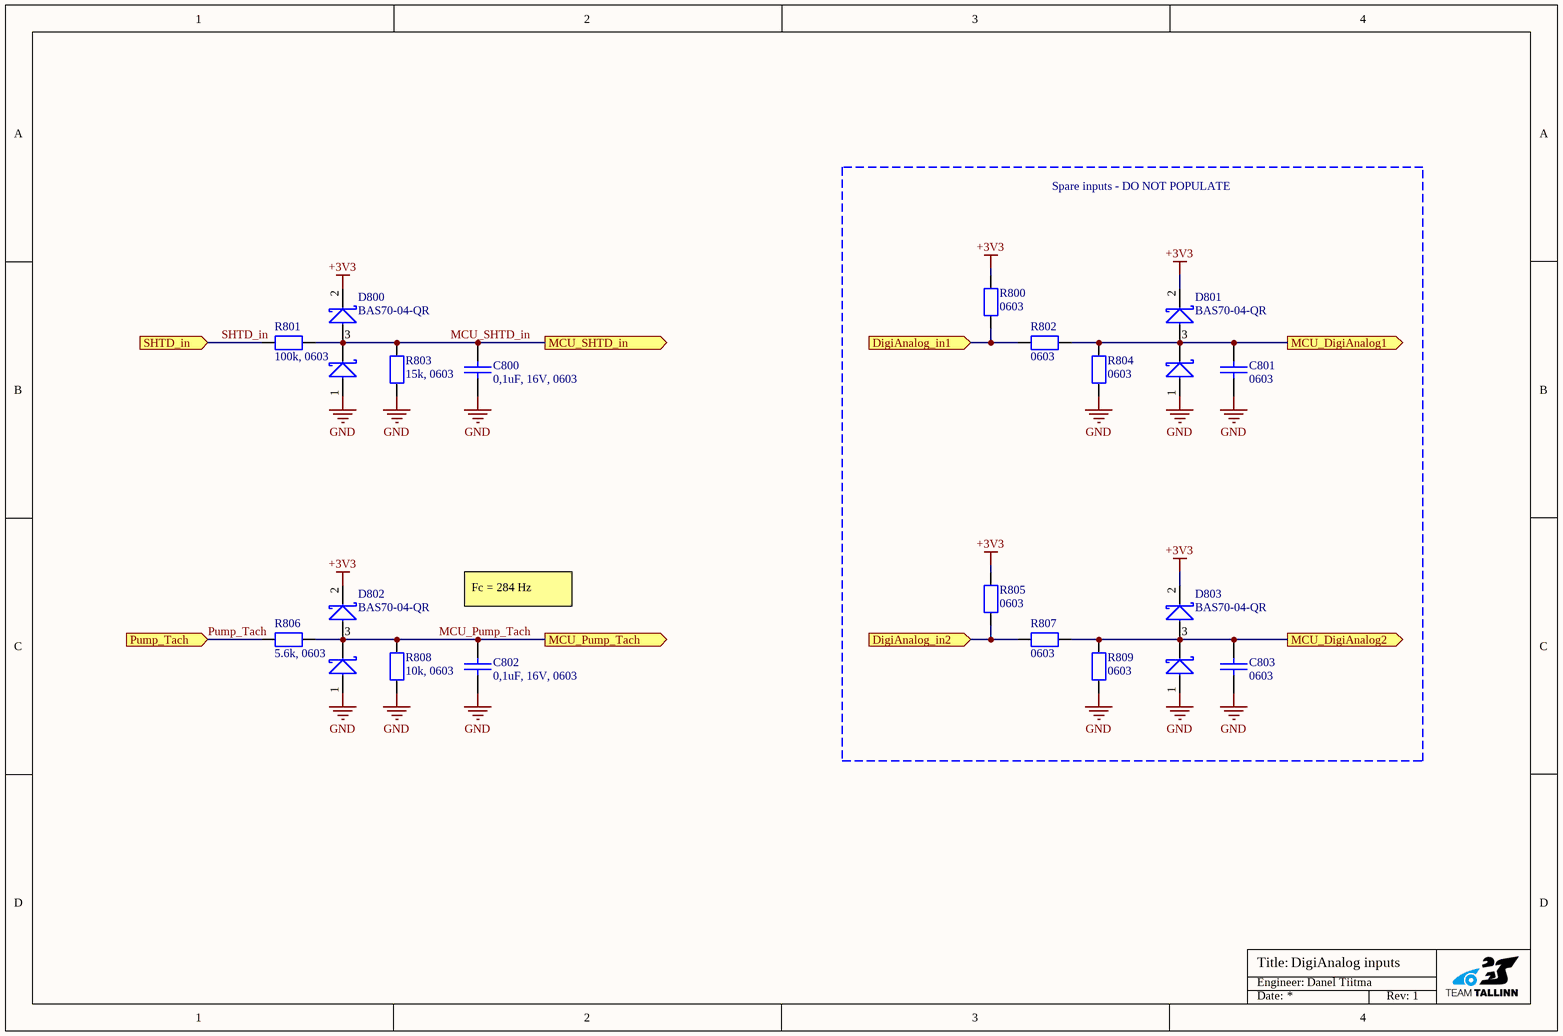
[diagram p6: DigiAnalog_Inputs.SchDoc]

### Parts
C800  0,1uF, 16V, 0603  [CAP [0603] 1608]
C801  0603  [CAP [0603] 1608]
C802  0,1uF, 16V, 0603  [CAP [0603] 1608]
C803  0603  [CAP [0603] 1608]
D800  BAS70-04-QR  [SOT23-3]
D801  BAS70-04-QR  [SOT23-3]
D802  BAS70-04-QR  [SOT23-3]
D803  BAS70-04-QR  [SOT23-3]
R800  0603  [RES [0603] 1608]
R801  100k, 0603  [RES [0603] 1608]
R802  0603  [RES [0603] 1608]
R803  15k, 0603  [RES [0603] 1608]
R804  0603  [RES [0603] 1608]
R805  0603  [RES [0603] 1608]
R806  5.6k, 0603  [RES [0603] 1608]
R807  0603  [RES [0603] 1608]
R808  10k, 0603  [RES [0603] 1608]
R809  0603  [RES [0603] 1608]

### Blocks framed on the sheet
Spare inputs - DO NOT POPULATE: C801 C803 D801 D803 R800 R802 R804 R805 R807 R809

### Ports
DigiAnalog_in1 (in), DigiAnalog_in2 (in), MCU_DigiAnalog1 (out), MCU_DigiAnalog2 (out), MCU_Pump_Tach (out), MCU_SHTD_in (out), Pump_Tach (in), SHTD_in (in)

### Nets
+3V3: D800.2 D801.2 D802.2 D803.2 R800.2 R805.2
GND: C800.2 C801.2 C802.2 C803.2 D800.1 D801.1 D802.1 D803.1 R803.1 R804.1 R808.1 R809.1
DigiAnalog_in1: R800.1 R802.2 ; port DigiAnalog_in1
DigiAnalog_in2: R805.1 R807.2 ; port DigiAnalog_in2
MCU_DigiAnalog1: C801.1 D801.3 R802.1 R804.2 ; port MCU_DigiAnalog1
MCU_DigiAnalog2: C803.1 D803.3 R807.1 R809.2 ; port MCU_DigiAnalog2
MCU_Pump_Tach: C802.1 D802.3 R806.2 R808.2 ; port MCU_Pump_Tach
MCU_SHTD_in: C800.1 D800.3 R801.2 R803.2 ; port MCU_SHTD_in
Pump_Tach: R806.1 ; port Pump_Tach
SHTD_in: R801.1 ; port SHTD_in

### Notes on the sheet
- Fc = 284 Hz
- Title:
- Engineer:
- Date:
- Rev:

### Library data of the parts
C800-C803 = CMP-001-00084-16: Default capacitor part; Supplier Part Number: *; Supplier: *; Manufacturer Part Number: *
D800-D803 = CMP-004-00033-4: as D600 on sheet Temperature_inputs; Supplier Part Number: 771-BAS70-04-QR; Manufacturer Part Number: BAS70-04-QR; Supplier: Mouser; Price: 0,242
R800-R809 = CMP-009-00038-12: Standard resistor part; Supplier Part Number: *; Manufacturer Part Number: *; Supplier: *

## Sheet Motor_Temp_Measurement.SchDoc: Motor temp measure
size A4; Engineer: Danel Tiitma; DocumentNumber: 12; Revision: 1; SheetNumber: 13; SheetTotal: 15
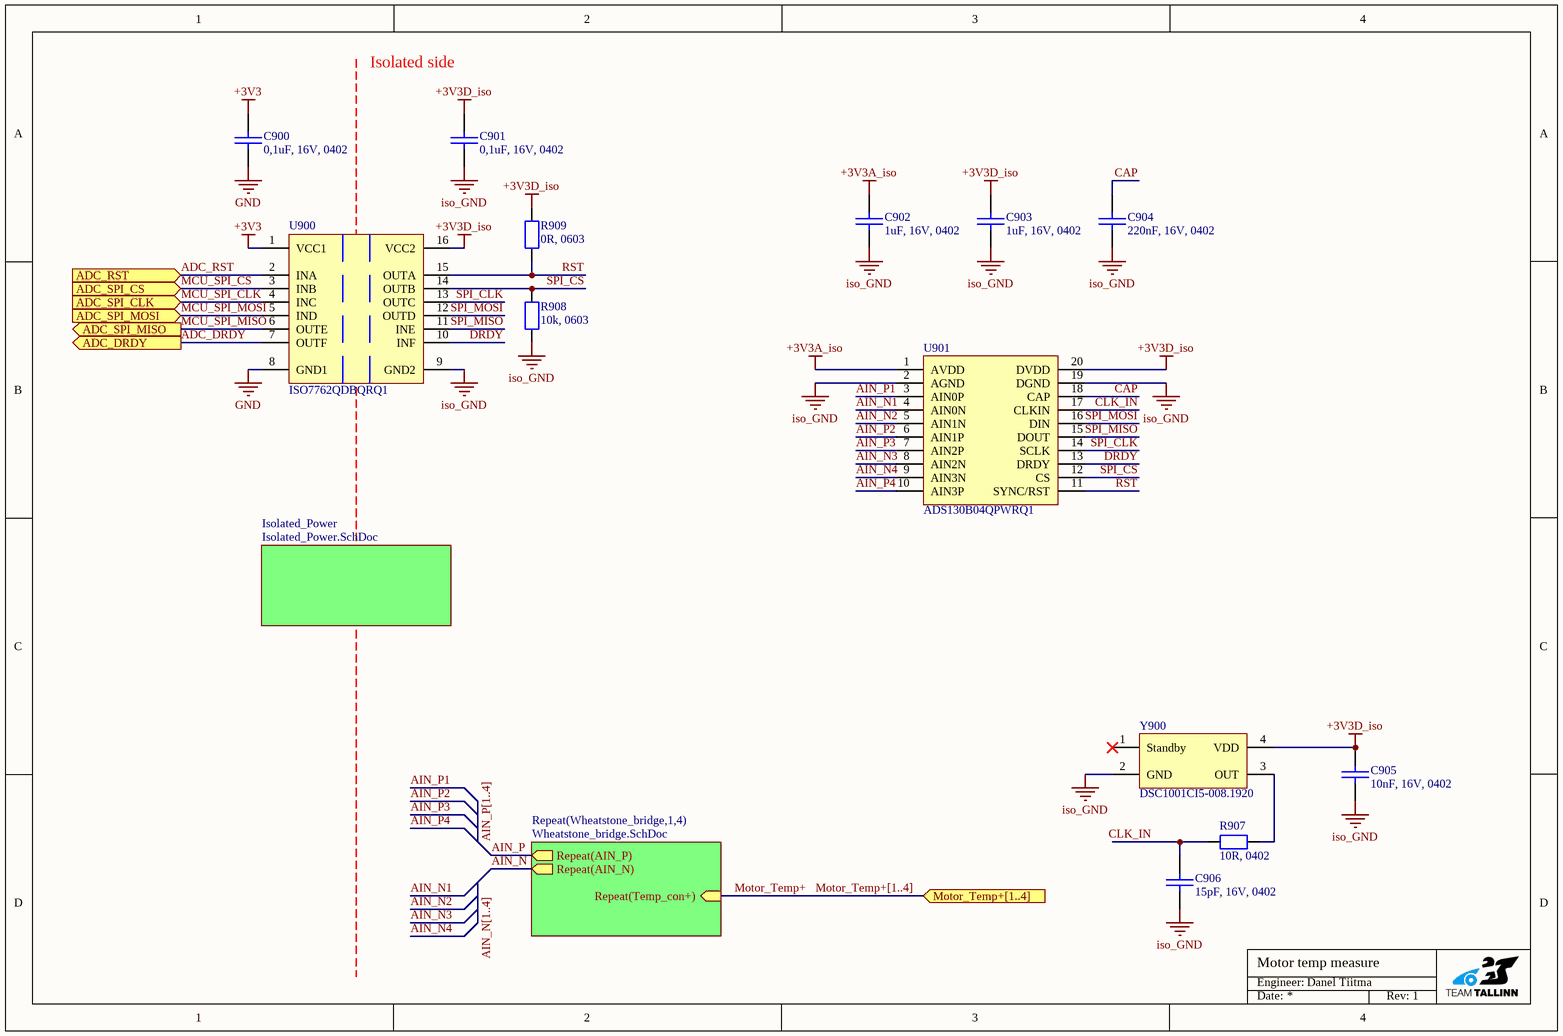
[diagram p7: Motor_Temp_Measurement.SchDoc]

### Parts
C900  0,1uF, 16V, 0402  [CAP [0402] 1005]
C901  0,1uF, 16V, 0402  [CAP [0402] 1005]
C902  1uF, 16V, 0402  [CAP [0402] 1005]
C903  1uF, 16V, 0402  [CAP [0402] 1005]
C904  220nF, 16V, 0402  [CAP [0402] 1005]
C905  10nF, 16V, 0402  [CAP [0402] 1005]
C906  15pF, 16V, 0402  [CAP [0402] 1005]
R907  10R, 0402  [RES [0402] 1005]
R908  10k, 0603  [RES [0603] 1608]
R909  0R, 0603  [RES [0603] 1608]
U900  ISO7762QDBQRQ1  [SSOP-16]
U901  ADS130B04QPWRQ1  [TSSOP-20]
Y900  DSC1001CI5-008.1920  [Crystal 3.2x2.5mm]

### Sub-sheets
Isolated_Power = Isolated_Power.SchDoc: no entries
Repeat(Wheatstone_bridge,1,4) = Wheatstone_bridge.SchDoc: Repeat(AIN_P) (out), Repeat(AIN_N) (out), Repeat(Temp_con+) (in)

### Ports
ADC_DRDY (out), ADC_RST (in), ADC_SPI_CLK (in), ADC_SPI_CS (in), ADC_SPI_MISO (out), ADC_SPI_MOSI (in), Motor_Temp+[1..4] (in)

### Nets
+3V3: C900.1 U900.1(VCC1)
+3V3A_iso: C902.2 U901.1(AVDD)
+3V3D_iso: C901.2 C903.2 C905.1 R909.1 U900.16(VCC2) U901.20(DVDD) Y900.4(VDD)
GND: C900.2 U900.8(GND1)
iso_GND: C901.1 C902.1 C903.1 C904.1 C905.2 C906.1 R908.2 U900.9(GND2) U901.2(AGND) U901.19(DGND) Y900.2(GND)
ADC_DRDY: U900.7(OUTF) ; port ADC_DRDY
ADC_RST: U900.2(INA) ; port ADC_RST
AIN_N: sheet Repeat(Wheatstone_bridge,1,4)/Repeat(AIN_N)
AIN_N1: U901.4(AIN0N)  [project net AIN_N]
AIN_N2: U901.5(AIN1N)  [project net AIN_N]
AIN_N3: U901.8(AIN2N)  [project net AIN_N]
AIN_N4: U901.9(AIN3N)  [project net AIN_N]
AIN_P: sheet Repeat(Wheatstone_bridge,1,4)/Repeat(AIN_P)
AIN_P1: U901.3(AIN0P)  [project net AIN_P]
AIN_P2: U901.6(AIN1P)  [project net AIN_P]
AIN_P3: U901.7(AIN2P)  [project net AIN_P]
AIN_P4: U901.10(AIN3P)  [project net AIN_P]
CAP: C904.2 U901.18(CAP)
CLK_IN: C906.2 R907.2 U901.17(CLKIN)
DRDY: U900.10(INF) U901.13(DRDY)
MCU_SPI_CLK: U900.4(INC) ; port ADC_SPI_CLK
MCU_SPI_CS: U900.3(INB) ; port ADC_SPI_CS
MCU_SPI_MISO: U900.6(OUTE) ; port ADC_SPI_MISO
MCU_SPI_MOSI: U900.5(IND) ; port ADC_SPI_MOSI
Motor_Temp+: sheet Repeat(Wheatstone_bridge,1,4)/Repeat(Temp_con+)
RST: R909.2 U900.15(OUTA) U901.11(SYNC/RST)
SPI_CLK: U900.13(OUTC) U901.14(SCLK)
SPI_CS: R908.1 U900.14(OUTB) U901.12(CS)
SPI_MISO: U900.11(INE) U901.15(DOUT)
SPI_MOSI: U900.12(OUTD) U901.16(DIN)
NetR907_1: R907.1 Y900.3(OUT)

Not connected (* = marked no-connect by the designer): Y900 1(Standby)*

### Buses and harness runs
bus AIN_N[1..4]
bus AIN_P[1..4]
bus Motor_Temp+[1..4] = port Motor_Temp+[1..4]

### Notes on the sheet
- Isolated side
- Engineer:
- Date:
- Rev:

### Library data of the parts
C900-C906 = CMP-001-00084-16: Default capacitor part; Supplier Part Number: *; Supplier: *; Manufacturer Part Number: *
R907-R909 = CMP-009-00038-12: Standard resistor part; Supplier Part Number: *; Manufacturer Part Number: *; Supplier: *
U900 = CMP-015-00010-2: Interface Circuit, CMOS, PDSO16; Manufacturer: Texas Instruments; Supplier: Mouser; Manufacturer Part Number: ISO7762QDBQRQ1; Price: 3,87; Datasheet: https://www.ti.com/general/docs/suppproductinfo.tsp?distId=26&gotoUrl=https://www.ti.com/lit/gpn/iso7762-q1; Supplier Part Number: 595-ISO7762QDBQRQ1
U901 = CMP-00029-4: Automotive 16-bit, 32-kSPS, four-channel, simultaneous-sampling, delta-sigma ADC 20-TSSOP -40 to 125; Manufacurer: Texas Instruments; Supplier: Digikey; Datasheet: https://www.ti.com/lit/ds/symlink/ads130b04-q1.pdf; Supplier Part Number: 296-ADS130B04QPWRQ1CT-ND; Manufacturer Part Number: ADS130B04QPWRQ1; Price: 6.28
Y900 = CMP-003-00000-1: CMOS Output Clock Oscillator, 8.192MHz Nom; Manufacturer Part Number: DSC1001DI5-008.1920T; Manufacturer: Microchip; Supplier: Mouser; Datasheet: https://www.mouser.ee/datasheet/2/268/MCHP_S_A0003587227_1-2520798.pdf; Supplier Part Number: 998-1001DI5008.1920T

## Sheet Wheatstone_bridge.SchDoc: Wheatstone bridge
size A4; Engineer: Danel Tiitma; DocumentNumber: 14; Revision: 1; SheetNumber: 15; SheetTotal: 15
Used 4 times, as channels Motor Temp Measurement/Wheatstone_bridge1, Motor Temp Measurement/Wheatstone_bridge2, Motor Temp Measurement/Wheatstone_bridge3, Motor Temp Measurement/Wheatstone_bridge4. Parts and nets are listed once, with the designators drawn on the sheet.
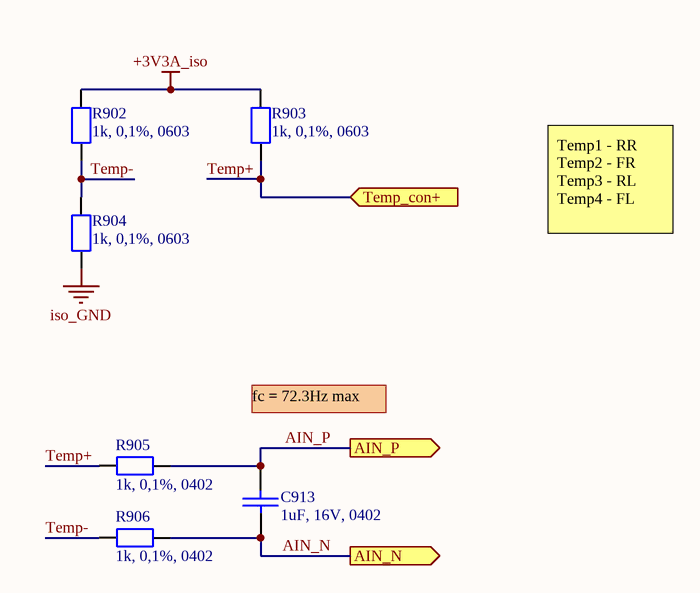
[diagram p8: Wheatstone_bridge.SchDoc]

### Parts
C913  1uF, 16V, 0402  [CAP [0402] 1005]
R902  1k, 0,1%, 0603  [RES [0603] 1608]
R903  1k, 0,1%, 0603  [RES [0603] 1608]
R904  1k, 0,1%, 0603  [RES [0603] 1608]
R905  1k, 0,1%, 0402  [RES [0402] 1005]
R906  1k, 0,1%, 0402  [RES [0402] 1005]

### Ports
AIN_N (out), AIN_P (out), Temp_con+ (in)

### Nets
+3V3A_iso: R902.1 R903.1
iso_GND: R904.2
AIN_N: C913.2 R906.1 ; port AIN_N
AIN_P: C913.1 R905.1 ; port AIN_P
Temp+: R903.2 R905.2 ; port Temp_con+
Temp-: R902.2 R904.1 R906.2

### Channels
Motor Temp Measurement/Wheatstone_bridge1: designators end in 1; ports AIN_N=AIN_N AIN_P=AIN_P Temp_con+=Motor_Temp+1
Motor Temp Measurement/Wheatstone_bridge2: designators end in 2; ports AIN_N=AIN_N AIN_P=AIN_P Temp_con+=Motor_Temp+2
Motor Temp Measurement/Wheatstone_bridge3: designators end in 3; ports AIN_N=AIN_N AIN_P=AIN_P Temp_con+=Motor_Temp+3
Motor Temp Measurement/Wheatstone_bridge4: designators end in 4; ports AIN_N=AIN_N AIN_P=AIN_P Temp_con+=Motor_Temp+4

### Notes on the sheet
- Temp1 - RR
  Temp2 - FR
  Temp3 - RL
  Temp4 - FL
- fc = 72.3Hz max
- Engineer:
- Date:
- Rev:

### Library data of the parts
C913 = CMP-001-00084-16: Default capacitor part; Supplier Part Number: *; Supplier: *; Manufacturer Part Number: *
R902-R904 = CMP-009-00017-1: Fixed Resistor, Thin Film, 0.1W, 1000ohm, 75V, 0.1% +/-Tol, 25ppm/Cel, Surface Mount, 0603; Manufacturer: Panasonic; Manufacturer Part Number: ERA-3AEB102V; Price: 0.288; Supplier Part Number: 667-ERA-3AEB102V; Supplier: Mouser
R905 R906 = CMP-009-00038-12: Standard resistor part; Supplier Part Number: *; Manufacturer Part Number: *; Supplier: *

## Sheet Isolated_Power.SchDoc: Isolated power
size A4; Engineer: Danel Tiitma; DocumentNumber: 13; Revision: 1; SheetNumber: 14; SheetTotal: 15
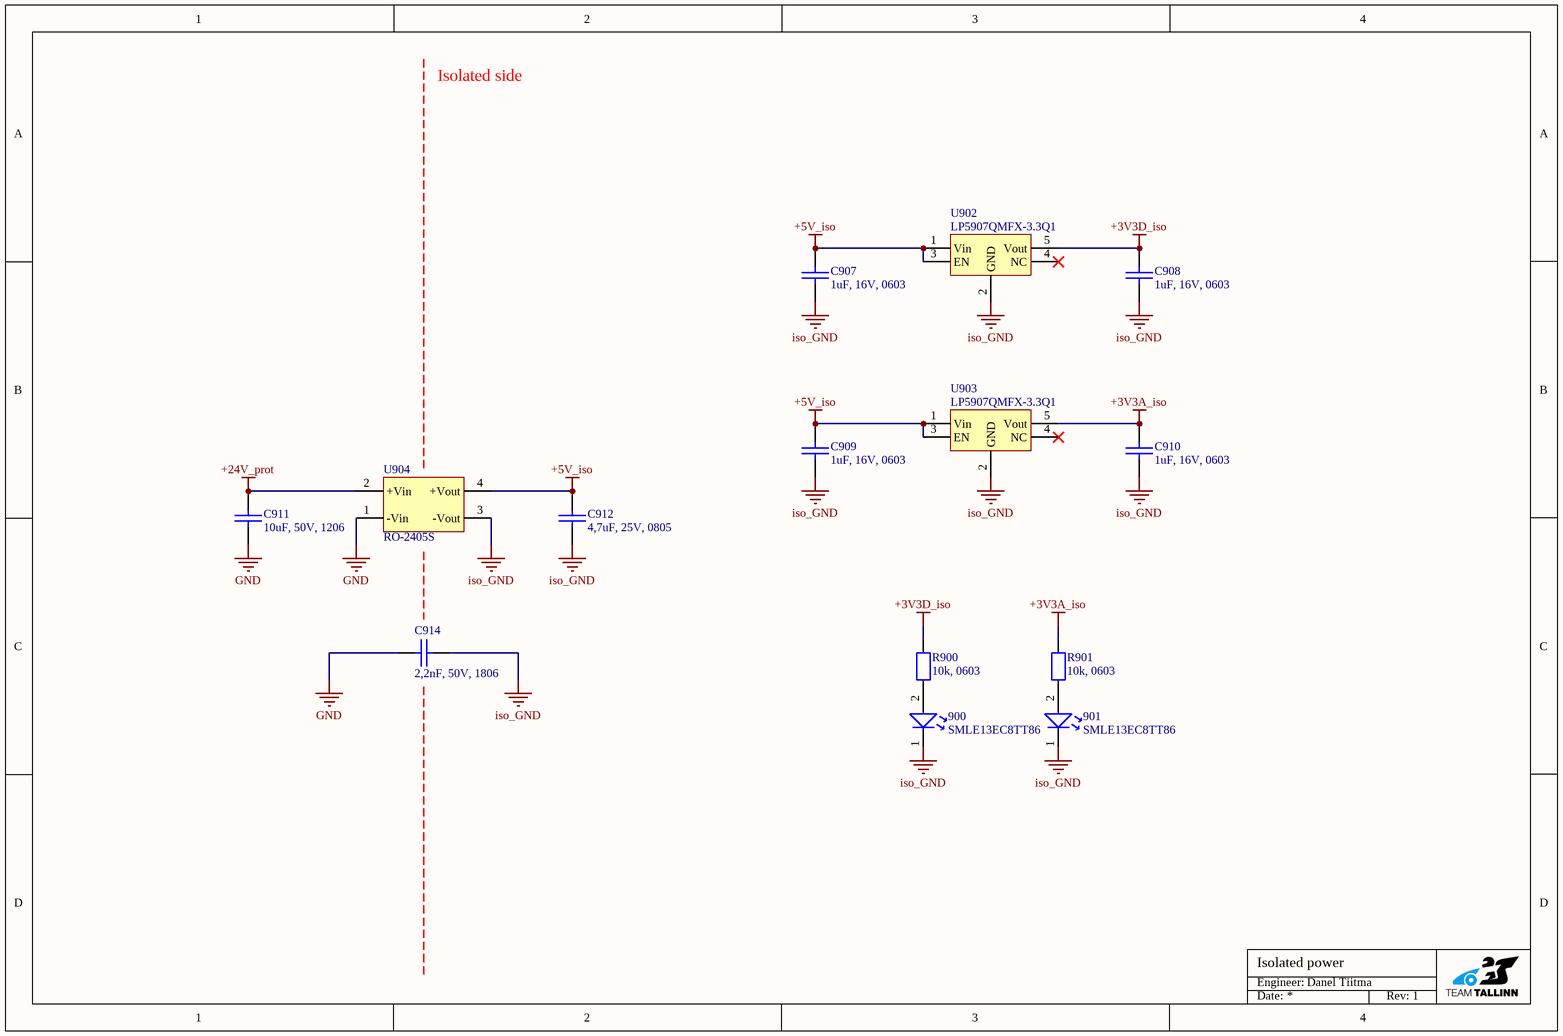
[diagram p9: Isolated_Power.SchDoc]

### Parts
900  SMLE13EC8TT86  [LED [0603] 1608]
901  SMLE13EC8TT86  [LED [0603] 1608]
C907  1uF, 16V, 0603  [CAP [0603] 1608]
C908  1uF, 16V, 0603  [CAP [0603] 1608]
C909  1uF, 16V, 0603  [CAP [0603] 1608]
C910  1uF, 16V, 0603  [CAP [0603] 1608]
C911  10uF, 50V, 1206  [CAP [1206] 3216]
C912  4,7uF, 25V, 0805  [CAP [0805] 2012]
C914  2,2nF, 50V, 1806  [CAP [1806] 4516]
R900  10k, 0603  [RES [0603] 1608]
R901  10k, 0603  [RES [0603] 1608]
U902  LP5907QMFX-3.3Q1  [SOT23-5]
U903  LP5907QMFX-3.3Q1  [SOT23-5]
U904  RO-2405S  [SIP-4]

### Nets
+3V3A_iso: C910.2 R901.2 U903.5(Vout)
+3V3D_iso: C908.2 R900.2 U902.5(Vout)
+5V_iso: C907.2 C909.2 C912.2 U902.1(Vin) U902.3(EN) U903.1(Vin) U903.3(EN) U904.4(+Vout)
+24V_prot: C911.2 U904.2(+Vin)
GND: C911.1 C914.1 U904.1(-Vin)
iso_GND: 900.1 901.1 C907.1 C908.1 C909.1 C910.1 C912.1 C914.2 U902.2(GND) U903.2(GND) U904.3(-Vout)
Net900_2: 900.2 R900.1
Net901_2: 901.2 R901.1

Not connected (* = marked no-connect by the designer): U902 4(NC)*; U903 4(NC)*

### Notes on the sheet
- Isolated side
- Engineer:
- Date:
- Rev:

### Library data of the parts
900 901 = CMP-004-00006-2: as ERROR200 on sheet MCU_external_components; Manufacturer Part Number: SMLE13EC8TT86; Supplier Part Number: 755-SMLE13EC8TT86; Supplier: Mouser
C907-C912 C914 = CMP-001-00084-16: Default capacitor part; Supplier Part Number: *; Supplier: *; Manufacturer Part Number: *
R900 R901 = CMP-009-00038-12: Standard resistor part; Supplier Part Number: *; Manufacturer Part Number: *; Supplier: *
U902 U903 = CMP-019-00018-1: as U102 on sheet Power; Manufacturer Part Number: LP5907QMFX-3.3Q1; Supplier Part Number: 595-LP5907QMFX-3.3Q1; Supplier: Mouser
U904 = CMP-019-00004-3: DC-DC Unregulated Power Supply Module, 1 Output, 1W, Hybrid; Manufacturer: Recom Power; Supplier: Digikey; Price: 6.99; Supplier Part Number: 945-1225-ND; Manufacturer Part Number: RO-2405S

## Sheet Switched_Power.SchDoc: Switched Power
size A4; Engineer: Rain Sarapuu; DocumentNumber: 7; Revision: 1; SheetNumber: 8; SheetTotal: 15
Used 2 times, as channels Switched Power1, Switched Power2. Parts and nets are listed once, with the designators drawn on the sheet.
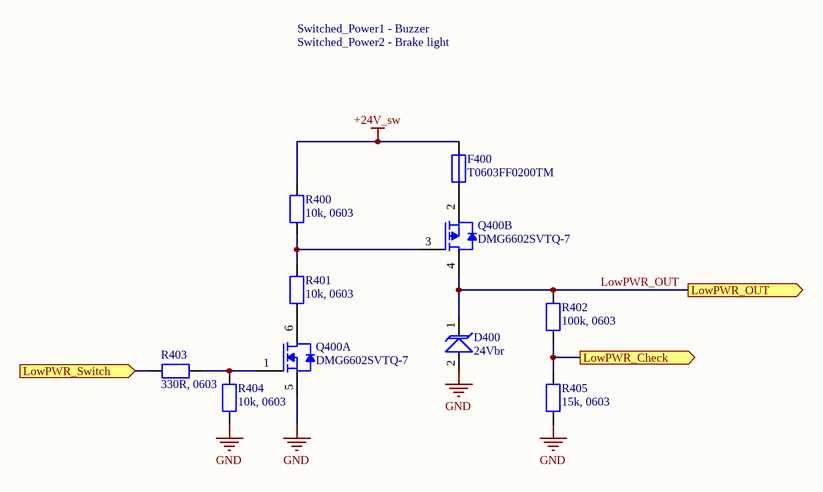
[diagram p10: Switched_Power.SchDoc]

### Parts
D400  24Vbr  [SOD-123W]
F400  T0603FF0200TM  [FUSE [0603] 1608]
Q400  DMG6602SVTQ-7  [SOT23-6]  (parts A,B of 2)
R400  10k, 0603  [RES [0603] 1608]
R401  10k, 0603  [RES [0603] 1608]
R402  100k, 0603  [RES [0603] 1608]
R403  330R, 0603  [RES [0603] 1608]
R404  10k, 0603  [RES [0603] 1608]
R405  15k, 0603  [RES [0603] 1608]

### Ports
LowPWR_Check (out), LowPWR_OUT (out), LowPWR_Switch (in)

### Nets
+24V_sw: F400.2 R400.2
GND: D400.2(A) Q400.5(S) R404.1 R405.1
LowPWR_Check: R402.1 R405.2 ; port LowPWR_Check
LowPWR_OUT: D400.1(K) Q400.4(D) R402.2 ; port LowPWR_OUT
LowPWR_Switch: R403.2 ; port LowPWR_Switch
NetF400_1: F400.1 Q400.2(S)
NetQ400_1: Q400.1(G) R403.1 R404.2
NetQ400_3: Q400.3(G) R400.1 R401.2
NetQ400_6: Q400.6(D) R401.1

### Channels
Switched Power1: designators end in 1; ports LowPWR_Check=LowPWR_Check1 LowPWR_OUT=LowPWR_OUT LowPWR_Switch=LowPWR_Switch1
Switched Power2: designators end in 2; ports LowPWR_Check=LowPWR_Check2 LowPWR_OUT=LowPWR_OUT LowPWR_Switch=LowPWR_Switch2

### Notes on the sheet
- Switched_Power1 - Buzzer
  Switched_Power2 - Brake light
- Engineer:
- Date:
- Rev:

### Library data of the parts
D400 = CMP-004-00014-3: as D101 on sheet Power; Supplier Part Number: 1829247; Datasheet: https://4donline.ihs.com/images/VipMasterIC/IC/NEXP/NEXP-S-A0003507774/NEXP-S-A0003507774-1.pdf?hkey=6D3A4C79FDBF58556ACFDE234799DDF0; Supplier: Farnell
F400 = CMP-005-00007-2: as F101 on sheet Power; Supplier Part Number: 3701343; Manufacturer Part Number: T0603FF0200TM; Supplier: Farnell
Q400 = CMP-013-00015-1: Small Signal Field-Effect Transistor, 2.7A I(D), 30V, 2-Element, N-Channel and P-Channel, Silicon, Metal-oxide Semiconductor FET; Supplier Part Number: 621-DMG6602SVTQ-7; Supplier: Mouser; Manufacturer Part Number: DMG6602SVTQ-7
R400-R405 = CMP-009-00038-12: Standard resistor part; Supplier Part Number: *; Manufacturer Part Number: *; Supplier: *

## Sheet Cooling_control.SchDoc: Cooling control
size A4; Engineer: Danel Tiitma; DocumentNumber: 8; Revision: 1; SheetNumber: 9; SheetTotal: 15
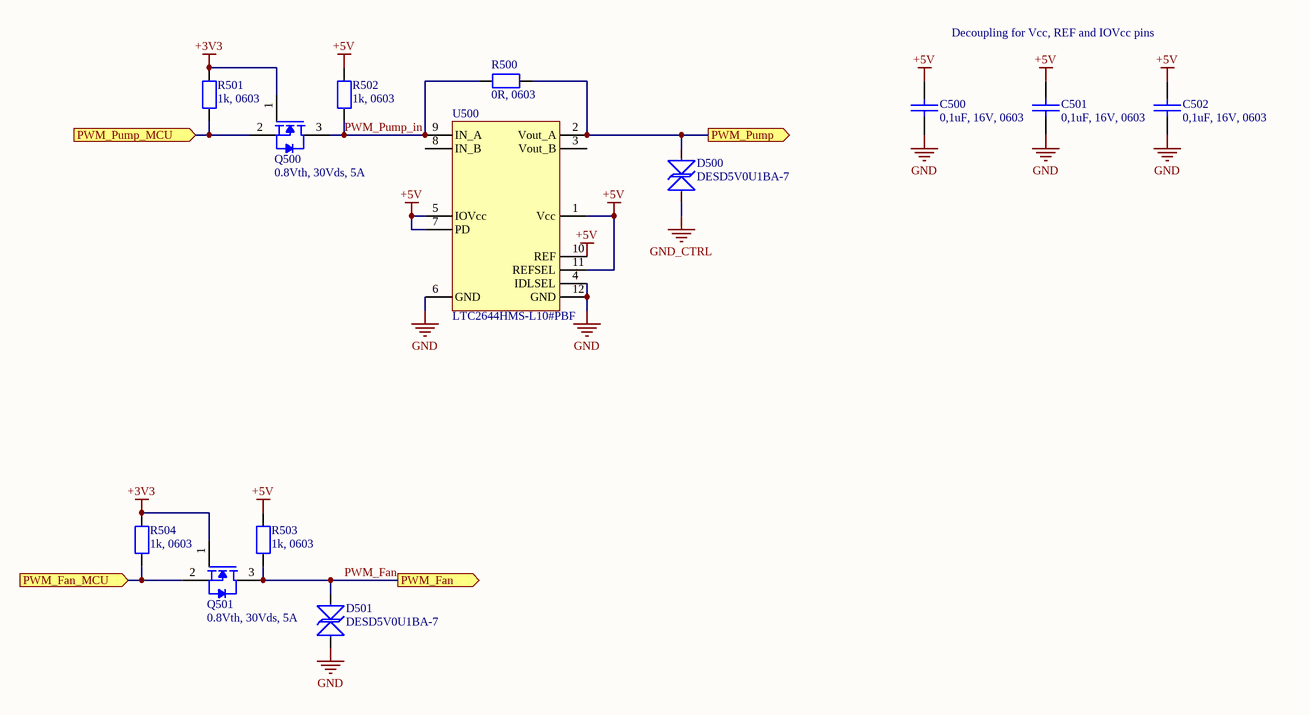
[diagram p11: Cooling_control.SchDoc]

### Parts
C500  0,1uF, 16V, 0603  [CAP [0603] 1608]
C501  0,1uF, 16V, 0603  [CAP [0603] 1608]
C502  0,1uF, 16V, 0603  [CAP [0603] 1608]
D500  DESD5V0U1BA-7  [SOD-323]
D501  DESD5V0U1BA-7  [SOD-323]
Q500  0.8Vth, 30Vds, 5A  [SOT23-3]
Q501  0.8Vth, 30Vds, 5A  [SOT23-3]
R500  0R, 0603  [RES [0603] 1608]
R501  1k, 0603  [RES [0603] 1608]
R502  1k, 0603  [RES [0603] 1608]
R503  1k, 0603  [RES [0603] 1608]
R504  1k, 0603  [RES [0603] 1608]
U500  LTC2644HMS-L10#PBF  [MSOP-12]

### Ports
PWM_Fan (out), PWM_Fan_MCU (in), PWM_Pump (out), PWM_Pump_MCU (in)

### Nets
+3V3: Q500.1(G) Q501.1(G) R501.2 R504.2
+5V: C500.1 C501.1 C502.1 R502.2 R503.2 U500.1(Vcc) U500.5(IOVcc) U500.7(PD) U500.10(REF) U500.11(REFSEL)
GND: C500.2 C501.2 C502.2 D501.2 U500.4(IDLSEL) U500.6(GND) U500.12(GND)
GND_CTRL: D500.2
PWM_Fan: D501.1 Q501.3(D) R503.1 ; port PWM_Fan
PWM_Pump: D500.1 R500.2 U500.2(Vout_A) ; port PWM_Pump
PWM_Pump_in: Q500.3(D) R500.1 R502.1 U500.9(IN_A)
NetQ500_2: Q500.2(S) R501.1 ; port PWM_Pump_MCU
NetQ501_2: Q501.2(S) R504.1 ; port PWM_Fan_MCU

Not connected (* = marked no-connect by the designer): U500 3(Vout_B) 8(IN_B)

### Notes on the sheet
- Decoupling for Vcc, REF and IOVcc pins
- Engineer:
- Date:
- Rev:

### Library data of the parts
C500-C502 = CMP-001-00084-16: Default capacitor part; Supplier: *; Supplier Part Number: *; Manufacturer Part Number: *
D500 D501 = CMP-004-00046-2: Trans Voltage Suppressor Diode, 5V V(RWM), Bidirectional, 1 Element, Silicon; Manufacturer: Diodes Inc.; Manufacturer Part Number: DESD5V0U1BA-7; Price: 0,233; Datasheet: https://www.diodes.com/assets/Datasheets/DESD5V0U1BA.pdf; Supplier: Mouser; Supplier Part Number: 621-DESD5V0U1BA-7
Q500 Q501 = CMP-013-00008-1: Small Signal Field-Effect Transistor; Manufacturer Part Number: IRLML6344TRPBF; Supplier Part Number: 942-IRLML6344TRPBF; Supplier: Mouser
R500-R504 = CMP-009-00038-12: Standard resistor part; Supplier Part Number: *; Manufacturer Part Number: *; Supplier: *
U500 = CMP-00030-00005-1: IC DAC 10-BIT VOUT 12MSOP; Manufacturer: Mouser; Price: 8,50; Manufacturer Part Number: LTC2644HMS-L10#PBF; Supplier: Mouser; Supplier Part Number: 584-C2644HMS-L10PBF; Datasheet: https://www.mouser.ee/datasheet/2/609/LTC2644-3124593.pdf

## Sheet CAN_CTRL.SchDoc
size A4; SheetNumber: 7; SheetTotal: 15
Used 2 times, as channels CAN_CTRL1, CAN_CTRL2. Parts and nets are listed once, with the designators drawn on the sheet.
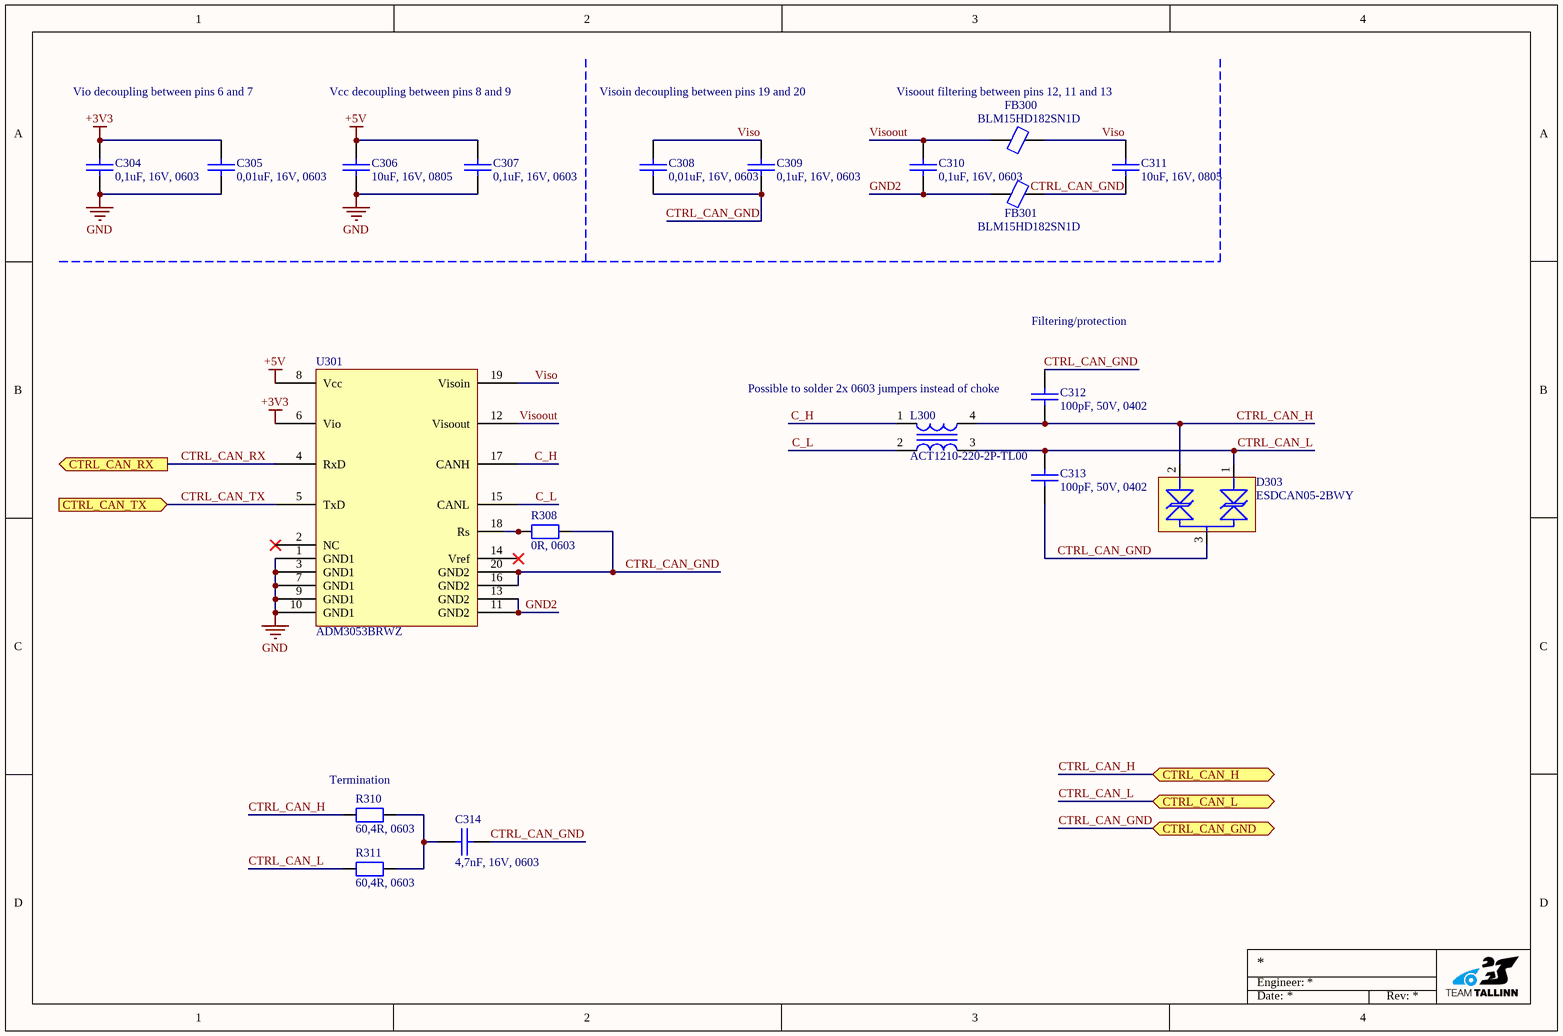
[diagram p12: CAN_CTRL.SchDoc]

### Parts
C304  0,1uF, 16V, 0603  [CAP [0603] 1608]
C305  0,01uF, 16V, 0603  [CAP [0603] 1608]
C306  10uF, 16V, 0805  [CAP [0805] 2012]
C307  0,1uF, 16V, 0603  [CAP [0603] 1608]
C308  0,01uF, 16V, 0603  [CAP [0603] 1608]
C309  0,1uF, 16V, 0603  [CAP [0603] 1608]
C310  0,1uF, 16V, 0603  [CAP [0603] 1608]
C311  10uF, 16V, 0805  [CAP [0805] 2012]
C312  100pF, 50V, 0402  [CAP [0402] 1005]
C313  100pF, 50V, 0402  [CAP [0402] 1005]
C314  4,7nF, 16V, 0603  [CAP [0603] 1608]
D303  ESDCAN05-2BWY  [SOT323/SC70-3]
FB300  BLM15HD182SN1D  [IND [0402] 1005]
FB301  BLM15HD182SN1D  [IND [0402] 1005]
L300  ACT1210-220-2P-TL00  [1210 Choke/ 2x0603 RES]
R308  0R, 0603  [RES [0603] 1608]
R310  60,4R, 0603  [RES [0603] 1608]
R311  60,4R, 0603  [RES [0603] 1608]
U301  ADM3053BRWZ  [SOIC-20]

### Ports
CTRL_CAN_GND (bidir), CTRL_CAN_H (bidir), CTRL_CAN_L (bidir), CTRL_CAN_RX (out), CTRL_CAN_TX (in)

### Nets
+3V3: C304.1 C305.1 U301.6(Vio)
+5V: C306.1 C307.1 U301.8(Vcc)
GND: C304.2 C305.2 C306.2 C307.2 U301.1(GND1) U301.3(GND1) U301.7(GND1) U301.9(GND1) U301.10(GND1)
C_H: L300.1 U301.17(CANH)
C_L: L300.2 U301.15(CANL)
CTRL_CAN_GND: C308.2 C309.2 C311.2 C312.2 C313.1 C314.2 D303.3 FB301.2 R308.1 U301.16(GND2) U301.20(GND2) ; port CTRL_CAN_GND
CTRL_CAN_H: C312.1 D303.2 L300.4 R310.2 ; port CTRL_CAN_H
CTRL_CAN_L: C313.2 D303.1 L300.3 R311.2 ; port CTRL_CAN_L
CTRL_CAN_RX: U301.4(RxD) ; port CTRL_CAN_RX
CTRL_CAN_TX: U301.5(TxD) ; port CTRL_CAN_TX
GND2: C310.2 FB301.1 U301.11(GND2) U301.13(GND2)
Viso: C308.1 C309.1 C311.1 FB300.2 U301.19(Visoin)
Visoout: C310.1 FB300.1 U301.12(Visoout)
NetC314_1: C314.1 R310.1 R311.1
NetR308_2: R308.2 U301.18(Rs)

Not connected (* = marked no-connect by the designer): U301 2(NC)* 14(Vref)*

### Channels
CAN_CTRL1: designators end in 1; ports CTRL_CAN_GND=CTRL_CAN_GND CTRL_CAN_H=CTRL_CAN_H CTRL_CAN_L=CTRL_CAN_L CTRL_CAN_RX=CTRL_CAN_RX CTRL_CAN_TX=CTRL_CAN_TX
CAN_CTRL2: designators end in 2; ports CTRL_CAN_GND=CTRL_CAN_GND CTRL_CAN_H=CTRL_CAN_H CTRL_CAN_L=CTRL_CAN_L CTRL_CAN_RX=CTRL_CAN_RX CTRL_CAN_TX=CTRL_CAN_TX

### Notes on the sheet
- Vio decoupling between pins 6 and 7
- Vcc decoupling between pins 8 and 9
- Visoin decoupling between pins 19 and 20
- Visoout filtering between pins 12, 11 and 13
- Filtering/protection
- (near C312) Possible to solder 2x 0603 jumpers instead of choke
- (near R310) Termination
- Engineer:
- Date:
- Rev:

### Library data of the parts
C304-C314 = CMP-001-00084-16: Default capacitor part; Supplier Part Number: *; Supplier: *; Manufacturer Part Number: *
D303 = CMP-004-00048-1: Trans Voltage Suppressor Diode, 170W, 36V V(RWM), Bidirectional, 2 Element, Silicon; Manufacturer: STMicroelectronics; Manufacturer Part Number: ESDCAN05-2BWY; Datasheet: https://www.st.com/resource/en/datasheet/esdcan06-2bwy.pdf; Supplier: Digikey; Supplier Part Number: 497-17303-1-ND; Price: 0,36
FB300 FB301 = CMP-006-00015-1: Ferrite Chip, 1 Function(s), 0.2A, 2 Pin(s); Manufacturer: Murata; Supplier: Digikey; Manufacturer Part Number: BLM15HD182SN1D; Supplier Part Number: 490-5196-1-ND; Price: 0.15
L300 = CMP-006-00025-2: Data Line Filter, 2 Function(s), 80V, 0.25A, 4 Pin(s); Manufacturer: TDK; Manufacturer Part Number: ACT1210-220-2P-TL00; Price: 1,51; Supplier: Mouser; Supplier Part Number: 810-ACT12102202PTL00
R308 R310 R311 = CMP-009-00038-12: Standard resistor part; Supplier Part Number: *; Manufacturer Part Number: *; Supplier: *
U301 = CMP-015-00008-3: Interface Circuit, 1-Trnsvr, PDSO20; Manufacturer: Analog Devices; Price: 13,48; Manufacturer Part Number: ADM3053BRWZ; Supplier Part Number: 584-ADM3053BRWZ-R7; Datasheet: https://www.mouser.ee/datasheet/2/609/ADM3053-3120613.pdf; Supplier: Mouser

## Sheet CAN.SchDoc: CAN transciever
size A4; Engineer: Danel Tiitma; DocumentNumber: 5; Revision: 1; SheetNumber: 5; SheetTotal: 15
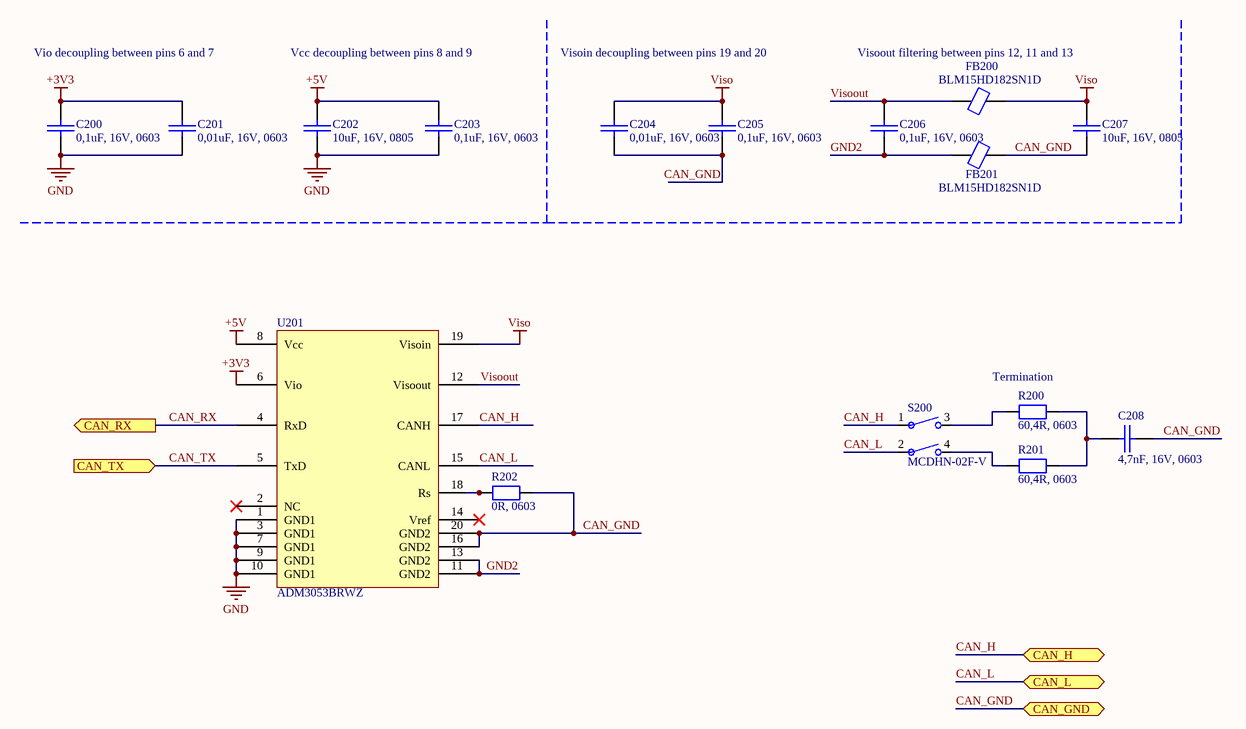
[diagram p13: CAN.SchDoc]

### Parts
C200  0,1uF, 16V, 0603  [CAP [0603] 1608]
C201  0,01uF, 16V, 0603  [CAP [0603] 1608]
C202  10uF, 16V, 0805  [CAP [0805] 2012]
C203  0,1uF, 16V, 0603  [CAP [0603] 1608]
C204  0,01uF, 16V, 0603  [CAP [0603] 1608]
C205  0,1uF, 16V, 0603  [CAP [0603] 1608]
C206  0,1uF, 16V, 0603  [CAP [0603] 1608]
C207  10uF, 16V, 0805  [CAP [0805] 2012]
C208  4,7nF, 16V, 0603  [CAP [0603] 1608]
FB200  BLM15HD182SN1D  [IND [0402] 1005]
FB201  BLM15HD182SN1D  [IND [0402] 1005]
R200  60,4R, 0603  [RES [0603] 1608]
R201  60,4R, 0603  [RES [0603] 1608]
R202  0R, 0603  [RES [0603] 1608]
S200  MCDHN-02F-V  [MCDHN-02F-V-Footprint-1]
U201  ADM3053BRWZ  [SOIC-20]

### Ports
CAN_GND (bidir), CAN_H (bidir), CAN_L (bidir), CAN_RX (out), CAN_TX (in)

### Nets
+3V3: C200.1 C201.1 U201.6(Vio)
+5V: C202.1 C203.1 U201.8(Vcc)
GND: C200.2 C201.2 C202.2 C203.2 U201.1(GND1) U201.3(GND1) U201.7(GND1) U201.9(GND1) U201.10(GND1)
Viso: C204.1 C205.1 C207.1 FB200.2 U201.19(Visoin)
CAN_GND: C204.2 C205.2 C207.2 C208.2 FB201.2 R202.1 U201.16(GND2) U201.20(GND2) ; port CAN_GND
CAN_H: S200.1 U201.17(CANH) ; port CAN_H
CAN_L: S200.2 U201.15(CANL) ; port CAN_L
CAN_RX: U201.4(RxD) ; port CAN_RX
CAN_TX: U201.5(TxD) ; port CAN_TX
GND2: C206.2 FB201.1 U201.11(GND2) U201.13(GND2)
Visoout: C206.1 FB200.1 U201.12(Visoout)
NetC208_1: C208.1 R200.1 R201.1
NetR200_2: R200.2 S200.3
NetR201_2: R201.2 S200.4
NetR202_2: R202.2 U201.18(Rs)

Not connected (* = marked no-connect by the designer): U201 2(NC)* 14(Vref)*

### Notes on the sheet
- Vio decoupling between pins 6 and 7
- Vcc decoupling between pins 8 and 9
- Visoin decoupling between pins 19 and 20
- Visoout filtering between pins 12, 11 and 13
- (near R200) Termination
- Engineer:
- Date:
- Rev:

### Library data of the parts
C200-C208 = CMP-001-00084-16: Default capacitor part; Supplier Part Number: *; Supplier: *; Manufacturer Part Number: *
FB200 FB201 = CMP-006-00015-1: as FB300 on sheet CAN_CTRL; Supplier: Digikey; Manufacturer Part Number: BLM15HD182SN1D; Supplier Part Number: 490-5196-1-ND; Price: 0.15
R200-R202 = CMP-009-00038-12: Standard resistor part; Supplier Part Number: *; Manufacturer Part Number: *; Supplier: *
S200 = CMP-011-00017-4: Slide Dip Switch, 2 Switches, SPST, Latched, 0.025A, 24VDC, Solder Terminal, Surface Mount-straight; Manufacturer: Multicomp Pro; Supplier Part Number: 1605473; Price: 1,26; Supplier: Farnell; Manufacturer Part Number: MCDHN-02F-V; Datasheet: https://www.farnell.com/datasheets/3723159.pdf
U201 = CMP-015-00008-3: as U301 on sheet CAN_CTRL; Price: 13,48; Manufacturer Part Number: ADM3053BRWZ; Supplier Part Number: 584-ADM3053BRWZ-R7; Datasheet: https://www.mouser.ee/datasheet/2/609/ADM3053-3120613.pdf; Supplier: Mouser